# Altium project DM1097_R0M0E0.PrjPcb (part 6 of 7)
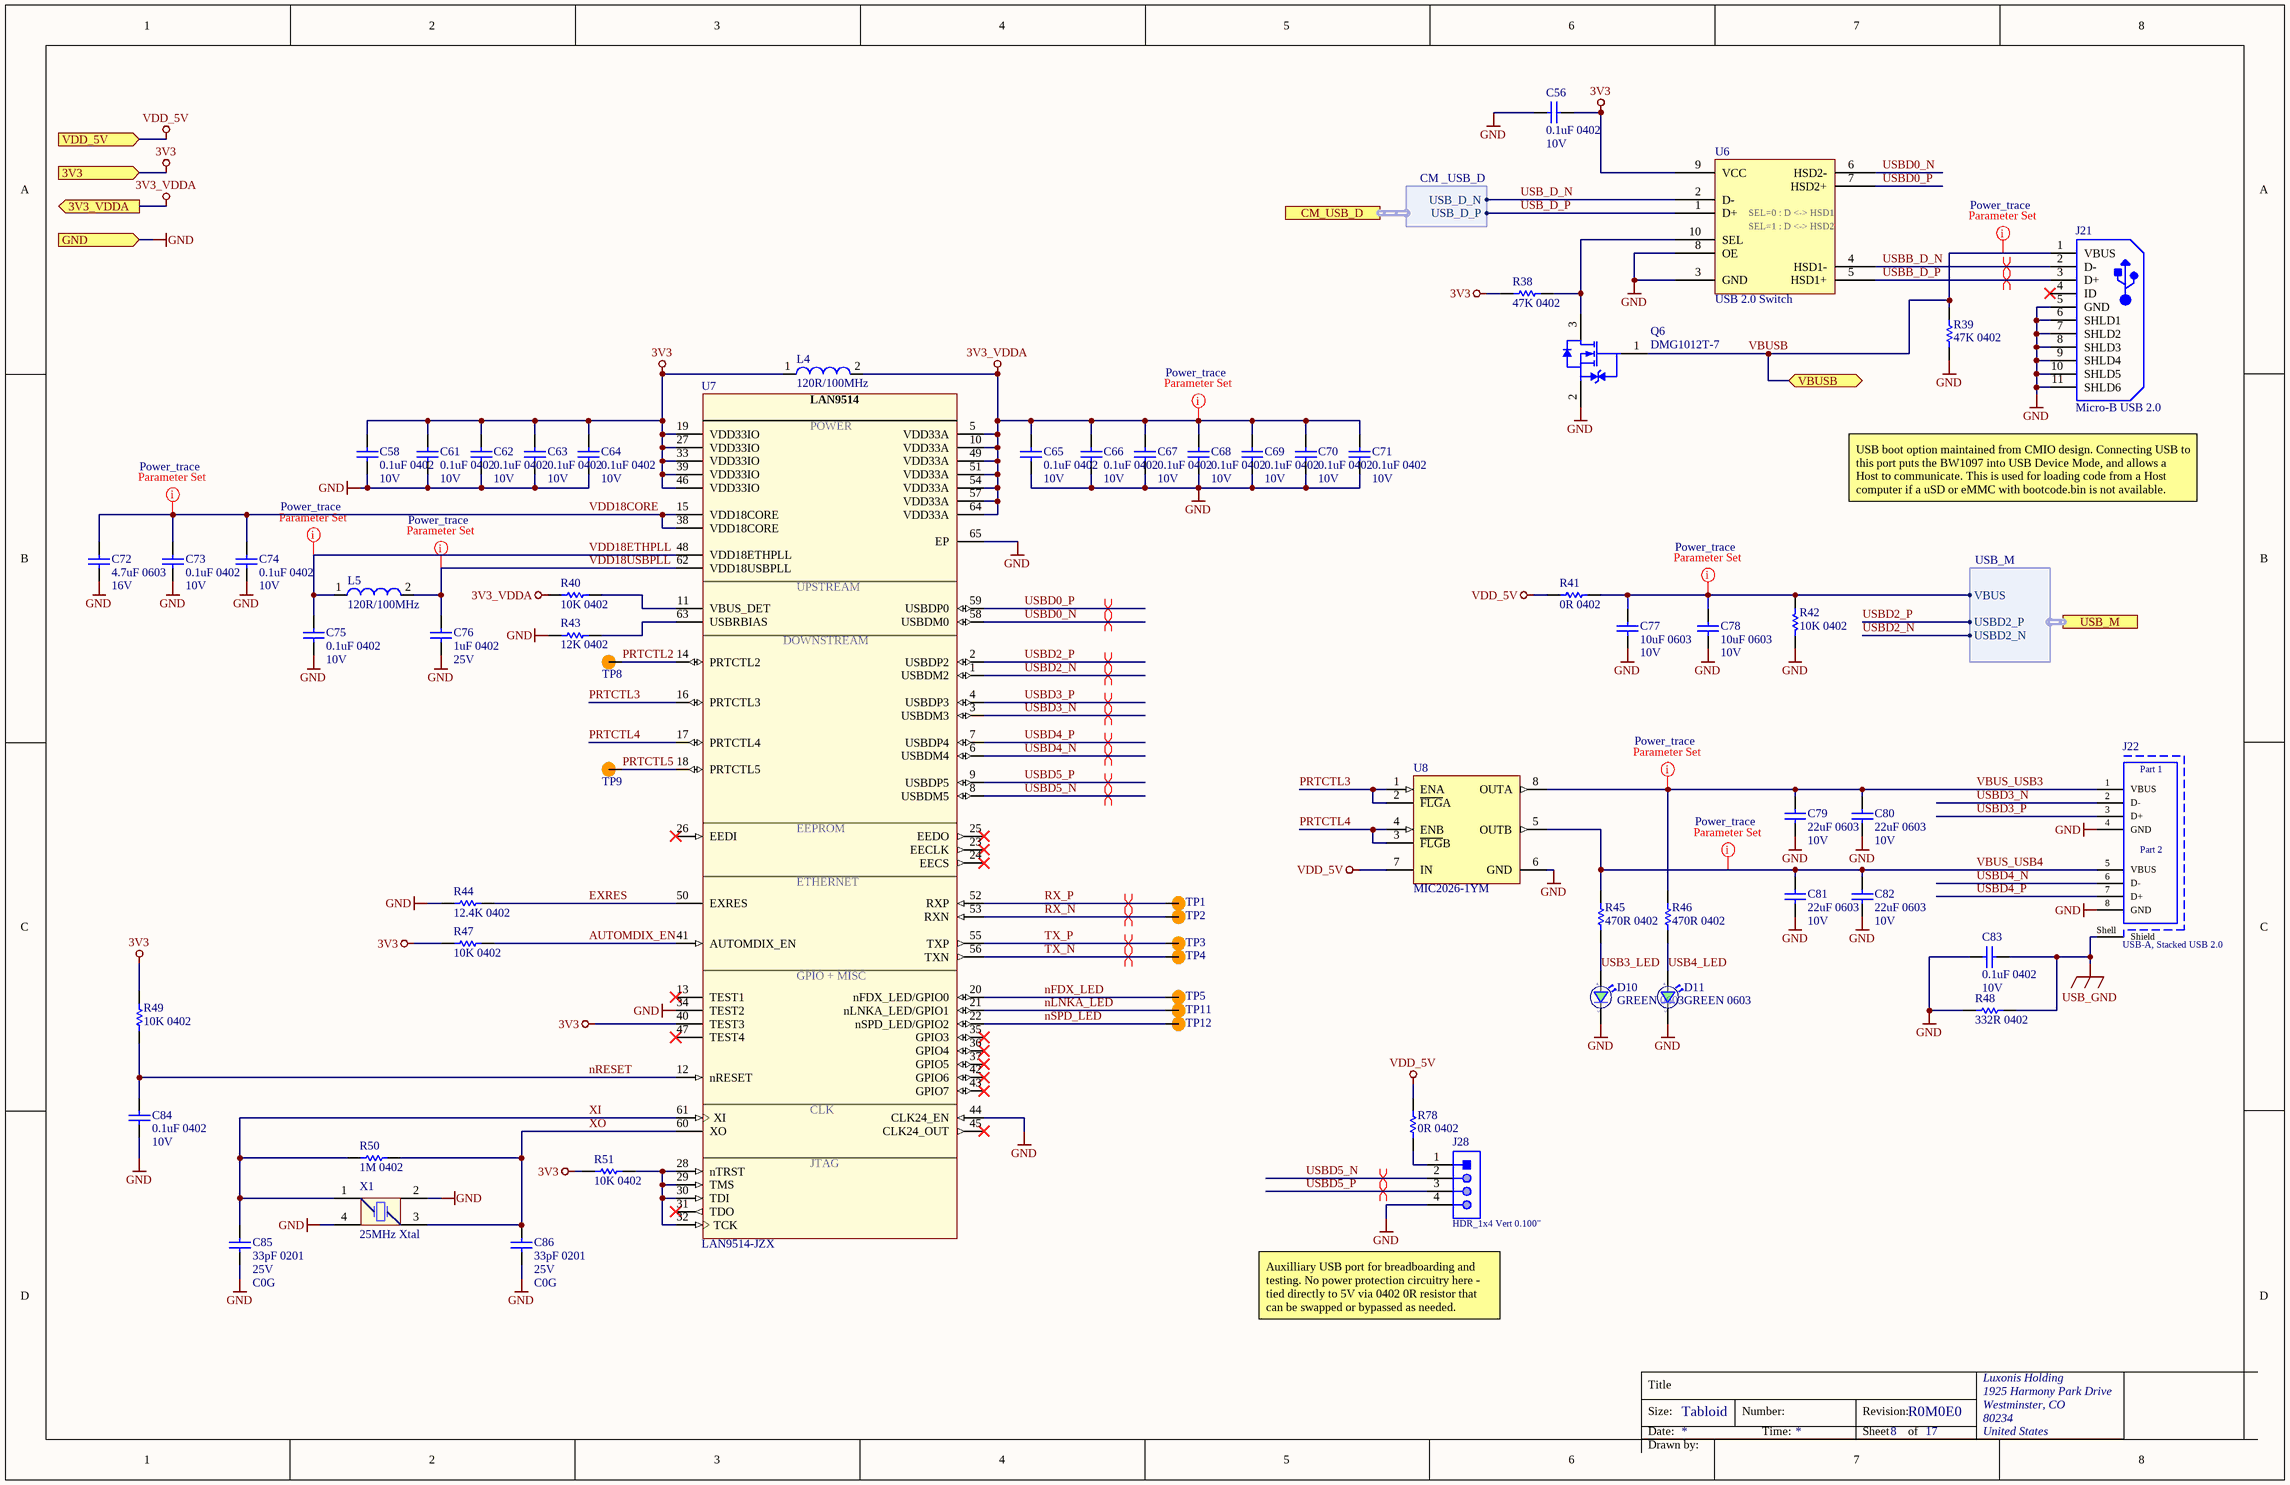
[diagram p15: DM1097_HUB.SchDoc]

## Sheet DM1097_HUB.SchDoc: =project_title (continued)

### Library data of the parts (continued)
X1 = 8Z-25.000MAAJ-T: CRYSTAL 25.0000MHZ 18PF SMD; Manufacturer 1: TXC; Frequency Tolerance: 30ppm; ESR (Equivalent Series Resistance): 100R; Manufacturer Part Number 1: 8Z-25.000MAAJ-T; Supplier 1: Digi-Key; Stock 1: 7343; Pricing 1: 1=1.36000, 10=1.30100, 50=1.27060, 100=1.08900, 500=1.05876, 1000=0.89238 (USD); RoHS: Yes; Mount: Surface Mount; Case/Package: SMD/SMT; Number of Pins: 4; Min Operating Temperature: -10°C; Max Operating Temperature: 70°C; Frequency: 25MHz; Load Capacitance: 18pF; Packaging: Tape and Reel; Package Quantity: 3000; Tolerance: 30ppm; Frequency Stability: 30ppm; Termination: SMD/SMT; Length: 2.5mm; Height: 0.022inch; Width: 2mm; Depth: 2.05mm; REACH SVHC: No SVHC; Lead Free: Lead Free; ComponentLink1URL: https://datasheet.ciiva.com/26833/getdatasheetpartid-743023-26833236.pdf?src-supplier=Verical; ComponentLink1Description: https://datasheet.ciiva.com/26833/getdatasheetpartid-743023-26833236.pdf?src-supplier=Verical; ComponentLink2URL: https://datasheet.ciiva.com/22698/1041872-22698773.pdf?src-supplier=Element14; ComponentLink2Description: https://datasheet.ciiva.com/22698/1041872-22698773.pdf?src-supplier=Element14; ComponentLink3URL: https://datasheet.ciiva.com/1356/number-crystal-basic-1356678.pdf?src-supplier=Element14; ComponentLink3Description: https://datasheet.ciiva.com/1356/number-crystal-basic-1356678.pdf?src-supplier=Element14; ComponentLink4URL: https://datasheet.ciiva.com/859/8z-859017.pdf?src-supplier=Digi-Key; ComponentLink4Description: https://datasheet.ciiva.com/859/8z-859017.pdf?src-supplier=Digi-Key; ComponentLink5URL: https://datasheet.ciiva.com/859/8z-859018.pdf?src-supplier=Digi-Key; ComponentLink5Description: https://datasheet.ciiva.com/859/8z-859018.pdf?src-supplier=Digi-Key; ComponentLink6URL: https://datasheet.ciiva.com/859/8z-859019.pdf?src-supplier=Digi-Key; ComponentLink6Description: https://datasheet.ciiva.com/859/8z-859019.pdf?src-supplier=Digi-Key; Supplier 2: Mouser; Supplier Part Number 1: 887-1145-1-ND; Supplier Part Number 2: 717-8Z-25.000MAAJ-T

## Sheet DM1097_IMX378.SchDoc: =project_title
size Tabloid; PageSetup: Record=PageOptions|CenterHorizontal=True|CenterVertical=True|PrintScale=0.71|XCorrection=1.00|YCorrection=1.00|PrintKind=0|BorderSize=5000000|LeftOffset=0|BottomOffset=0|Orientation=2|PaperLength=1000|PaperWidth=1000|Scale=100|PaperSource=7|PrintQuality=-4|MediaType=1|DitherType=10|PrintScaleMode=1|PaperKind=A4; CompanyName: Luxonis Holding; DrawnBy: David Malovrh; Organization: Luxonis Holding; Address1: 1925 Harmony Park Drive; Address2: Westminster, CO; Address3: 80234; Address4: United States; DocumentNumber: D0000200; Revision: R0M0E0; SheetNumber: 4; SheetTotal: 17
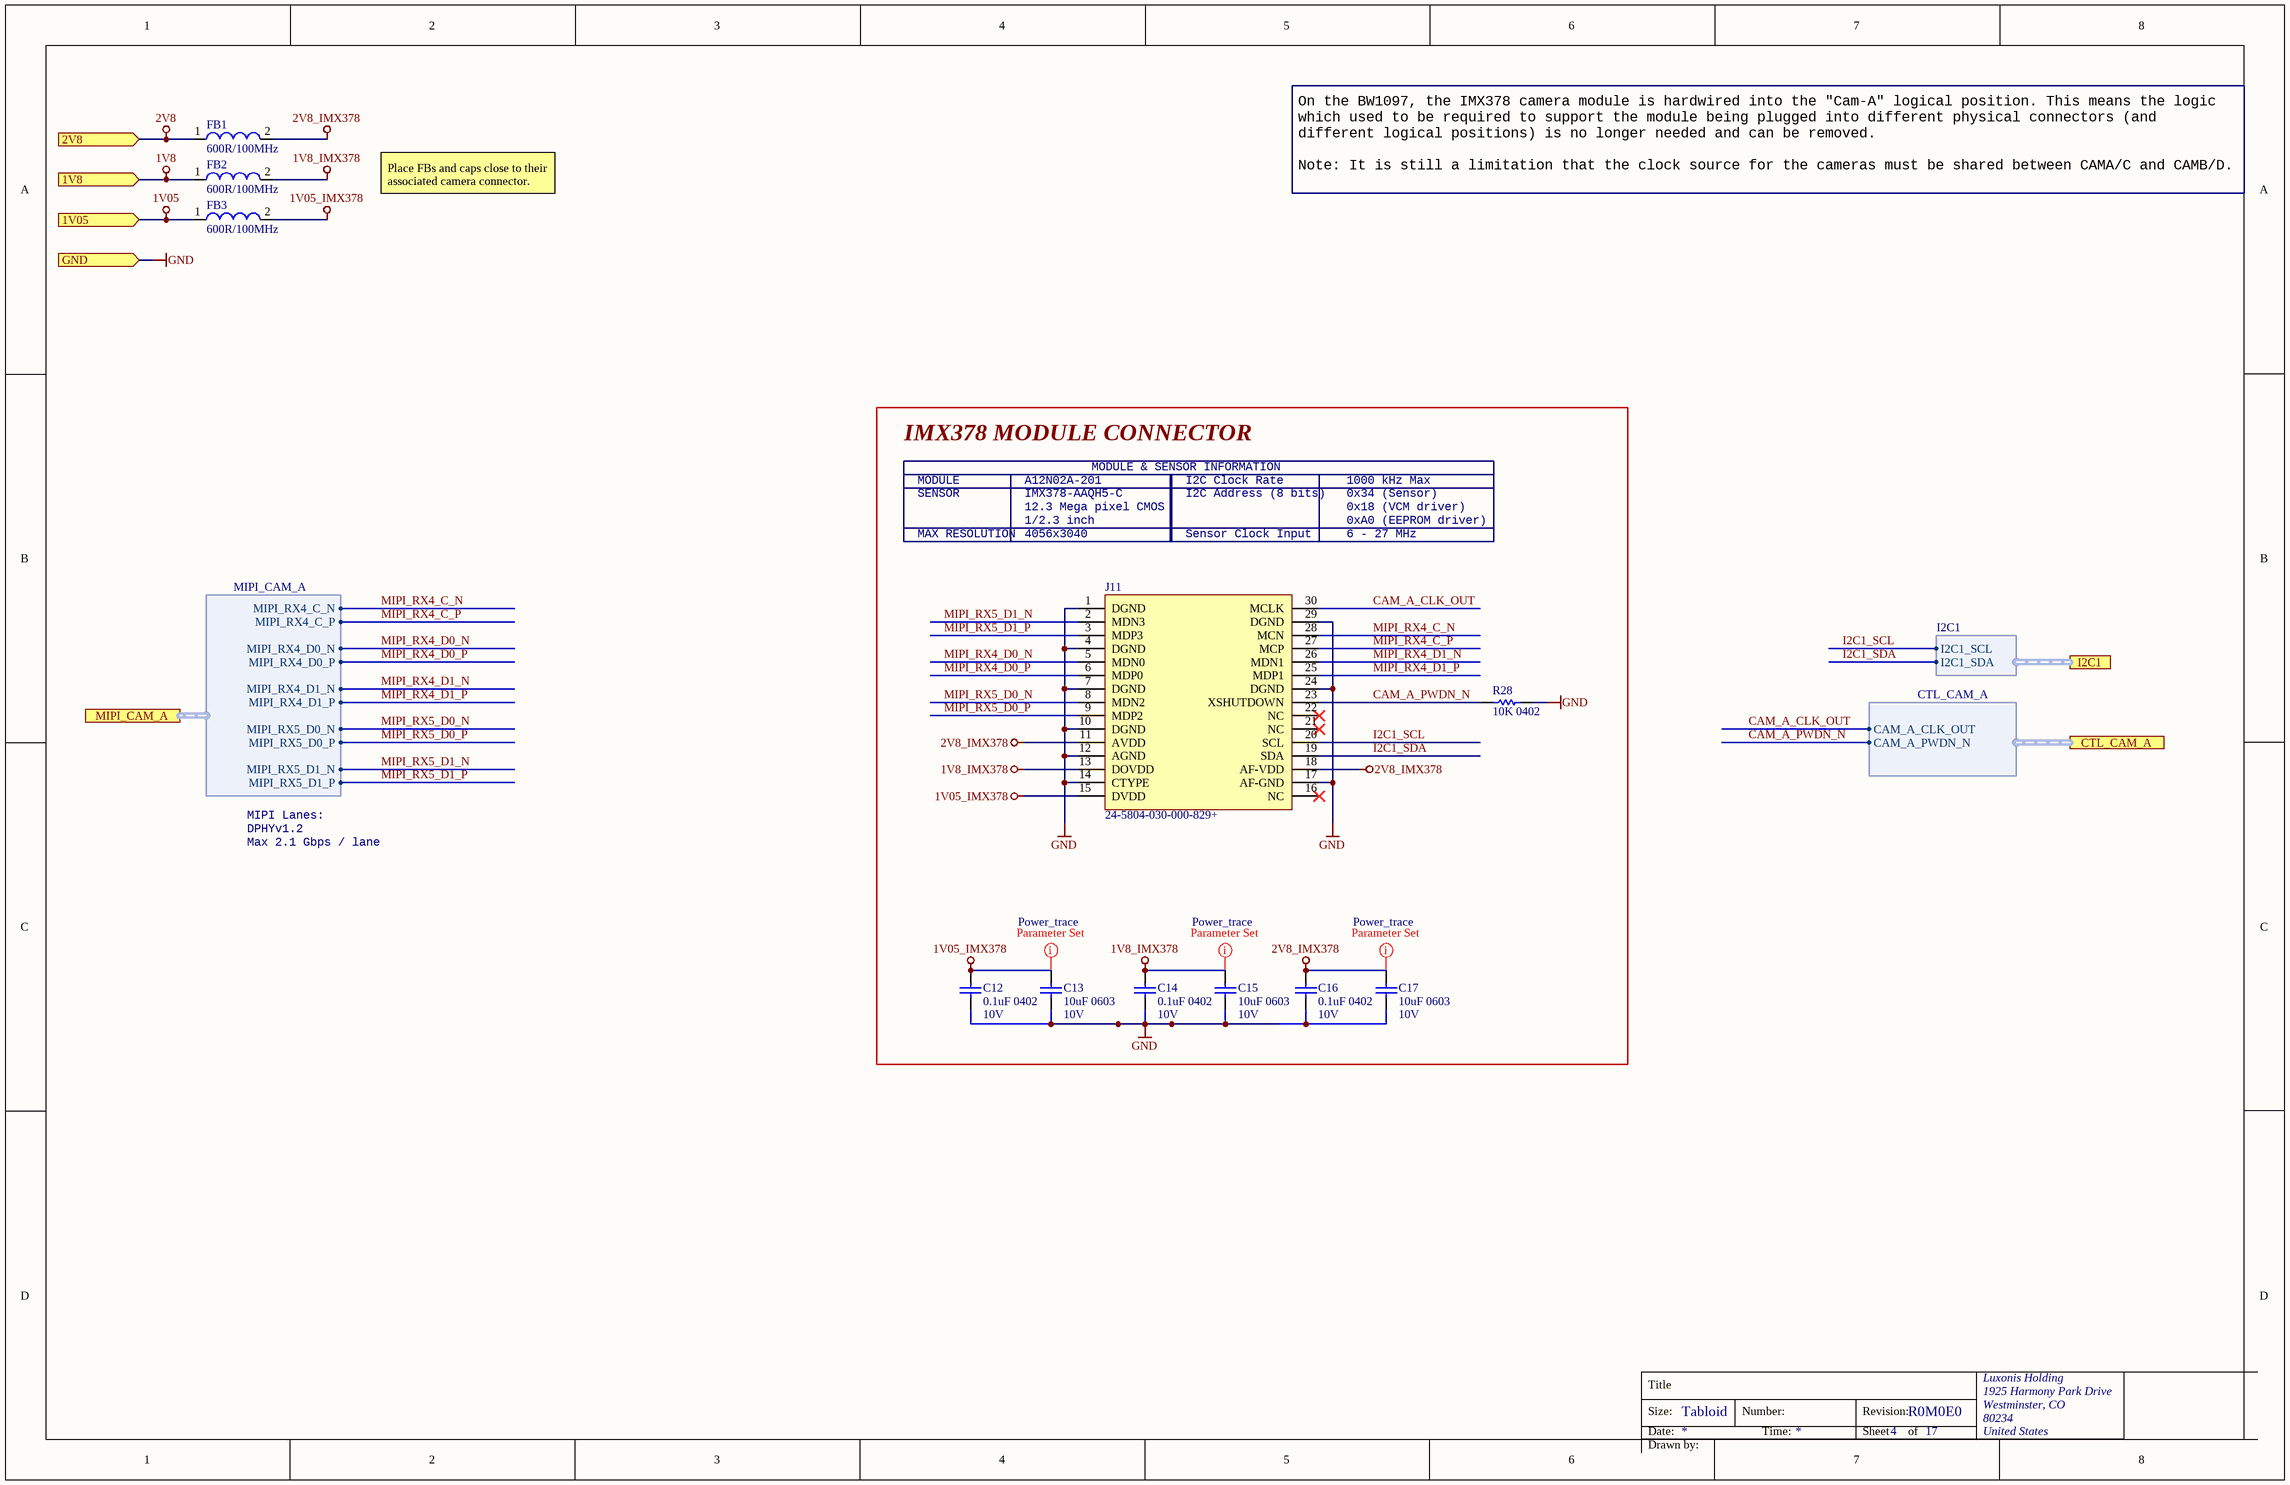
[diagram p5: DM1097_IMX378.SchDoc]

### Parts
C12  0.1uF 0402  Voltage Rating: 10V  [CAPC0402(1005)70_N]
C13  10uF 0603  Voltage Rating: 10V  [CAPC0603(1608)100_N]
C14  0.1uF 0402  Voltage Rating: 10V  [CAPC0402(1005)70_N]
C15  10uF 0603  Voltage Rating: 10V  [CAPC0603(1608)100_N]
C16  0.1uF 0402  Voltage Rating: 10V  [CAPC0402(1005)70_N]
C17  10uF 0603  Voltage Rating: 10V  [CAPC0603(1608)100_N]
FB1  600R/100MHz  [2508056017Y2]
FB2  600R/100MHz  [2508056017Y2]
FB3  600R/100MHz  [2508056017Y2]
J11  24-5804-030-000-829+  [A12N02A-201_MatedModule]
R28  10K 0402  [RESC0402(1005)_N]

### Blocks framed on the sheet
IMX378 MODULE CONNECTOR: C12-C17 J11 R28

### Ports
1V05 (in), 1V8 (in), 2V8 (in), CTL_CAM_A (harness CTL_CAM_A), GND (in), I2C1 (harness I2C1), MIPI_CAM_A (harness MIPI_CAM_A)

### Harnesses
I2C1: I2C1_SDA, I2C1_SCL
MIPI_CAM_A: MIPI_RX4_C_P, MIPI_RX4_C_N, MIPI_RX4_D0_P, MIPI_RX4_D0_N, MIPI_RX4_D1_P, MIPI_RX4_D1_N, MIPI_RX5_D0_P, MIPI_RX5_D0_N, MIPI_RX5_D1_P, MIPI_RX5_D1_N
CTL_CAM_A: CAM_A_PWDN_N, CAM_A_CLK_OUT

### Nets
1V05: FB3.1 ; port 1V05
1V05_IMX378: C12.2 C13.2 FB3.2 J11.15(DVDD)
1V8: FB2.1 ; port 1V8
1V8_IMX378: C14.2 C15.2 FB2.2 J11.13(DOVDD)
2V8: FB1.1 ; port 2V8
2V8_IMX378: C16.2 C17.2 FB1.2 J11.11(AVDD) J11.18(AF-VDD)
GND: C12.1 C13.1 C14.1 C15.1 C16.1 C17.1 J11.1(DGND) J11.4(DGND) J11.7(DGND) J11.10(DGND) J11.12(AGND) J11.14(CTYPE) J11.17(AF-GND) J11.24(DGND) J11.29(DGND) R28.2 ; port GND
CAM_A_CLK_OUT: J11.30(MCLK) ; port CTL_CAM_A.CAM_A_CLK_OUT
CAM_A_PWDN_N: J11.23(XSHUTDOWN) R28.1 ; port CTL_CAM_A.CAM_A_PWDN_N
I2C1_SCL: J11.20(SCL) ; port I2C1.I2C1_SCL
I2C1_SDA: J11.19(SDA) ; port I2C1.I2C1_SDA
MIPI_RX4_C_N: J11.28(MCN) ; port MIPI_CAM_A.MIPI_RX4_C_N
MIPI_RX4_C_P: J11.27(MCP) ; port MIPI_CAM_A.MIPI_RX4_C_P
MIPI_RX4_D0_N: J11.5(MDN0) ; port MIPI_CAM_A.MIPI_RX4_D0_N
MIPI_RX4_D0_P: J11.6(MDP0) ; port MIPI_CAM_A.MIPI_RX4_D0_P
MIPI_RX4_D1_N: J11.26(MDN1) ; port MIPI_CAM_A.MIPI_RX4_D1_N
MIPI_RX4_D1_P: J11.25(MDP1) ; port MIPI_CAM_A.MIPI_RX4_D1_P
MIPI_RX5_D0_N: J11.8(MDN2) ; port MIPI_CAM_A.MIPI_RX5_D0_N
MIPI_RX5_D0_P: J11.9(MDP2) ; port MIPI_CAM_A.MIPI_RX5_D0_P
MIPI_RX5_D1_N: J11.2(MDN3) ; port MIPI_CAM_A.MIPI_RX5_D1_N
MIPI_RX5_D1_P: J11.3(MDP3) ; port MIPI_CAM_A.MIPI_RX5_D1_P

Not connected (* = marked no-connect by the designer): J11 16(NC)* 21(NC)* 22(NC)*

### Layout directives
net class Power_trace: 1V05_IMX378, 1V8_IMX378, 2V8_IMX378

### Notes on the sheet
- Place FBs and caps close to their associated camera connector.
- On the BW1097, the IMX378 camera module is hardwired into the "Cam-A" logical position. This means the logic which used to be required to support the module being plugged into different physical connectors (and different logical positions) is no longer needed and can be removed.
  Note: It is still a limitation that the clock source for the cameras must be shared between CAMA/C and CAMB/D.
- SENSOR
- MODULE
- IMX378-AAQH5-C
- A12N02A-201
- MODULE & SENSOR INFORMATION
- I2C Address (8 bits)
- I2C Clock Rate
- 0x34 (Sensor)
- 1000 kHz Max
- MAX RESOLUTION
- 12.3 Mega pixel CMOS
- 4056x3040
- 1/2.3 inch
- Sensor Clock Input
- 0x18 (VCM driver)
- 0xA0 (EEPROM driver)
- 6 - 27 MHz
- MIPI Lanes:
- DPHYv1.2
- Max 2.1 Gbps / lane
- Title
- Size:
- Date:
- Tabloid
- Number:
- Time:
- Revision:
- Sheet
- of
- Drawn by:

### Library data of the parts
C12 C14 C16 = GRM155R71A104JA01D: CAP CER 0.1UF 10V X7R 0402 5%; Manufacturer 1: Murata; Capacitance: 100nF; Manufacturer Part Number 1: GRM155R71A104JA01D; Supplier 1: Digi-Key; Stock 1: 1346709; Pricing 1: 1=0.10000, 10=0.02500, 100=0.01130, 500=0.00806, 1000=0.00633, 2500=0.00575, 5000=0.00529 (USD); RoHS: Yes; Mount: Surface Mount; Case/Package: 0402; Case Code (Imperial): 0402; Case Code (Metric): 1005; Min Operating Temperature: -55°C; Max Operating Temperature: 125°C; Tolerance: 5%; Packaging: Tape and Reel; Voltage Rating (DC): 10V; Dielectric: X7R; Package Quantity: 10000; Termination: SMD/SMT; Length: 1mm; Height: 0.5mm; Width: 0.02inch; Thickness: 0.022inch; Depth: 0.5mm; Radiation Hardening: No; Lead Free: Lead Free; ComponentLink1URL: https://datasheet.ciiva.com/5411/product-5411135.pdf?src-supplier=Mouser; ComponentLink1Description: https://datasheet.ciiva.com/5411/product-5411135.pdf?src-supplier=Mouser; ComponentLink2URL: https://datasheet.ciiva.com/11618/c02e-11618821.pdf?src-supplier=Avnet; ComponentLink2Description: https://datasheet.ciiva.com/11618/c02e-11618821.pdf?src-supplier=Avnet; Supplier Part Number 1: 490-10777-1-ND
C13 C15 C17 = GRM188R61A106ME69D: CAP CER 10UF 10V X5R 0603 20%; Manufacturer 1: Murata; Material: Ceramic; Manufacturer Part Number 1: GRM188R61A106ME69D; Supplier 1: Digi-Key; Stock 1: 2873098; Pricing 1: 1=0.21000, 10=0.14100, 100=0.07130, 500=0.04876, 1000=0.04313 (USD); RoHS: Yes; Mount: Surface Mount; Case/Package: 0603; Weight: 0.000222oz; Case Code (Metric): 1608; Case Code (Imperial): 0603; Min Operating Temperature: -55°C; Max Operating Temperature: 85°C; Packaging: Tape and Reel; Tolerance: 20%; Capacitance: 10uF; Dielectric: X5R; Voltage Rating (DC): 10V; Package Quantity: 4000; Termination: SMD/SMT; Length: 1.6mm; Height: 0.8mm; Width: 0.8mm; Thickness: 0.035inch; Depth: 0.8mm; REACH SVHC: Unknown; Lead Free: Lead Free; ComponentLink1URL: http://www.mouser.com/ds/2/281/c02e-2905.pdf?src-supplier=Mouser; ComponentLink1Description: http://www.mouser.com/ds/2/281/c02e-2905.pdf?src-supplier=Mouser; ComponentLink2URL: http://components.arrow.com/part/dataview/0323_06119472?src-supplier=Arrow+Europe; ComponentLink2Description: http://components.arrow.com/part/dataview/0323_06119472?src-supplier=Arrow+Europe; ComponentLink3URL: http://www.farnell.com/datasheets/2048014.pdf?src-supplier=Farnell; ComponentLink3Description: http://www.farnell.com/datasheets/2048014.pdf?src-supplier=Farnell; ComponentLink4URL: http://www.farnell.com/datasheets/1872210.pdf?src-supplier=Farnell; ComponentLink4Description: http://www.farnell.com/datasheets/1872210.pdf?src-supplier=Farnell; ComponentLink5URL: http://search.murata.co.jp/Ceramy/image/img/A01X/G101/ENG/GRM188R61A106ME69-01.pdf?src-supplier=Digi-Key; ComponentLink5Description: http://search.murata.co.jp/Ceramy/image/img/A01X/G101/ENG/GRM188R61A106ME69-01.pdf?src-supplier=Digi-Key; ComponentLink6URL: http://www.farnell.com/datasheets/1872210.pdf?src-supplier=Newark; ComponentLink6Description: http://www.farnell.com/datasheets/1872210.pdf?src-supplier=Newark; ComponentLink7URL: http://www.farnell.com/datasheets/2048014.pdf?src-supplier=Element14; ComponentLink7Description: http://www.farnell.com/datasheets/2048014.pdf?src-supplier=Element14; ComponentLink8URL: http://www.farnell.com/datasheets/2048014.pdf?src-supplier=Newark; ComponentLink8Description: http://www.farnell.com/datasheets/2048014.pdf?src-supplier=Newark; Supplier Part Number 1: 490-10475-1-ND
FB1-FB3 = 2508056017Y2: FERRITE BEAD, 0.1OHM, 2A, 0805, 600R/100MHz; Manufacturer 1: Fair-Rite; Impedance: 600R; Tolerance: 25%; Resistance: 350mR; DC Resistance (DCR): 100mR; Test Frequency: 100MHz; Manufacturer Part Number 1: 2508056017Y2; Supplier 1: Digi-Key; Stock 1: 100491; Pricing 1: 1=0.10000, 10=0.07900, 25=0.07120, 50=0.05240, 100=0.04520, 250=0.03568, 500=0.03014, 1000=0.02538 (USD); RoHS: Yes; Case/Package: 0805; Number of Pins: 2; Case Code (Metric): 2012; Case Code (Imperial): 0805; Min Operating Temperature: -55°C; Max Operating Temperature: 125°C; Package Quantity: 4000; Packaging: Tape and Reel; Max DC Current: 2A; Termination: SMD/SMT; Military Standard: Not; DC Current: 2A; Current Rating: 2A; Frequency: 100MHz; Length: 2mm; Height: 0.9mm; Width: 1.25mm; Depth: 1.25mm; Radiation Hardening: No; REACH SVHC: No SVHC; ComponentLink1URL: https://datasheet.ciiva.com/3854/3802508056017y2-3854245.pdf?src-supplier=Arrow; ComponentLink1Description: https://datasheet.ciiva.com/3854/3802508056017y2-3854245.pdf?src-supplier=Arrow; ComponentLink2URL: https://datasheet.ciiva.com/22735/652149-22735047.pdf?src-supplier=Element14; ComponentLink2Description: https://datasheet.ciiva.com/22735/652149-22735047.pdf?src-supplier=Element14; ComponentLink3URL: https://datasheet.ciiva.com/1127/26143-1127514.pdf?src-supplier=Farnell; ComponentLink3Description: https://datasheet.ciiva.com/1127/26143-1127514.pdf?src-supplier=Farnell; ComponentLink4URL: https://datasheet.ciiva.com/18090/getdatasheetpartid-212640-18090187.pdf?src-supplier=Verical; ComponentLink4Description: https://datasheet.ciiva.com/18090/getdatasheetpartid-212640-18090187.pdf?src-supplier=Verical; ComponentLink5URL: https://datasheet.ciiva.com/7620/26143-7620140.pdf?src-supplier=Element14; ComponentLink5Description: https://datasheet.ciiva.com/7620/26143-7620140.pdf?src-supplier=Element14; Supplier Part Number 1: 1934-1487-1-ND
J11 = A12N02A-201_Connector: CONN Series 5804 board to board 0.4mm pitch 30 way connector; Manufacturer 1: Kyocera International Electronic Components; Manufacturer Part Number 1: 245804030000829+; MAN: AVX/KYOCERA; MAN PN: 24-5804-030-000-829+; Supplier 1: Digi-Key; Stock 1: 11469; Pricing 1: 1=1.69000, 10=1.53600, 25=1.44200, 50=1.37940, 100=1.31670, 250=1.19132, 500=1.09726, 1000=0.94050 (USD); RoHS: No; ComponentLink1URL: http://global.kyocera.com/prdct/electro/product/pdf/5804.pdf?src-supplier=Digi-Key; ComponentLink1Description: http://global.kyocera.com/prdct/electro/product/pdf/5804.pdf?src-supplier=Digi-Key; Supplier Part Number 1: 478-12013-1-ND
R28 = RC0402FR-1310KL: RES SMD 10K OHM 1% 0402 1/16W Chip Resistor, 0402 [1005 Metric], 10 kohm, RC Series, 50 V, Thick Film, 62.5 mW; Manufacturer 1: Yageo; Resistance: 10kR; Temperature Coefficient: 100ppm/°C; Power Rating: 62.5mW; Voltage Rating: 50V; Manufacturer Part Number 1: RC0402FR-1310KL; ComponentLink1URL: https://datasheet.ciiva.com/16940/pyu-rc0402-51-rohs-l-6-16940293.pdf?src-supplier=Avnet+Europe; ComponentLink1Description: https://datasheet.ciiva.com/16940/pyu-rc0402-51-rohs-l-6-16940293.pdf?src-supplier=Avnet+Europe; ComponentLink2URL: https://datasheet.ciiva.com/28386/pyu-rc0402-51-rohs-l-6-28386855.pdf?src-supplier=Avnet+Europe; ComponentLink2Description: https://datasheet.ciiva.com/28386/pyu-rc0402-51-rohs-l-6-28386855.pdf?src-supplier=Avnet+Europe; ComponentLink3URL: https://datasheet.ciiva.com/16740/pyu-rc0402-51-rohs-l-6-r-16740602.pdf?src-supplier=Future+Electronics; ComponentLink3Description: https://datasheet.ciiva.com/16740/pyu-rc0402-51-rohs-l-6-r-16740602.pdf?src-supplier=Future+Electronics; ComponentLink4URL: https://datasheet.ciiva.com/8891/pyu-rc0402-51-rohs-l-6-8891339.pdf?src-supplier=Avnet; ComponentLink4Description: https://datasheet.ciiva.com/8891/pyu-rc0402-51-rohs-l-6-8891339.pdf?src-supplier=Avnet; ComponentLink5URL: https://datasheet.ciiva.com/5557/pyu-rc0402-51-rohs-l-6-r-5557997.pdf?src-supplier=Mouser; ComponentLink5Description: https://datasheet.ciiva.com/5557/pyu-rc0402-51-rohs-l-6-r-5557997.pdf?src-supplier=Mouser; ComponentLink6URL: https://datasheet.ciiva.com/7983/1018594-7983533.pdf?src-supplier=Element14; ComponentLink6Description: https://datasheet.ciiva.com/7983/1018594-7983533.pdf?src-supplier=Element14; Supplier 1: Newark; Stock 1: 62239; Pricing 1: 1=0.10000, 25=0.01200, 100=0.00400, 250=0.00400, 500=0.00300, 1000=0.00300 (USD); RoHS: Yes; Case/Package: 0402; Number of Pins: 2; Contact Plating: Tin,Matte,Lead; Case Code (Imperial): 0402; Case Code (Metric): 1005; Min Operating Temperature: -55°C; Max Operating Temperature: 155°C; Tolerance: 1%; Composition: Thick Film; Packaging: Tape and Reel; Termination: SMD/SMT; Military Standard: Not; Voltage Rating (DC): 50V; Working Voltage: 50V; Number of Terminations: 2; Length: 1mm; Depth: 0.5mm; Radiation Hardening: No; REACH SVHC: No SVHC; Lead Free: Lead Free; Supplier Part Number 1: 67R9960; Supplier 2: Future Electronics; Supplier 3: Mouser; Supplier 4: Element14; Supplier Part Number 2: RC0402FR-1310KL-CUTT; Supplier Part Number 3: 603-RC0402FR-1310KL; Supplier Part Number 4: 1799235

## Sheet DM1097_MIPI_IO.SchDoc: =project_title
size Tabloid; CompanyName: Luxonis Holding; DrawnBy: David Malovrh; Organization: Luxonis Holding; Address1: 1925 Harmony Park Drive; Address2: Westminster, CO; Address3: 80234; Address4: United States; DocumentNumber: D0000200; Revision: R0M0E0; SheetNumber: 13; SheetTotal: 17
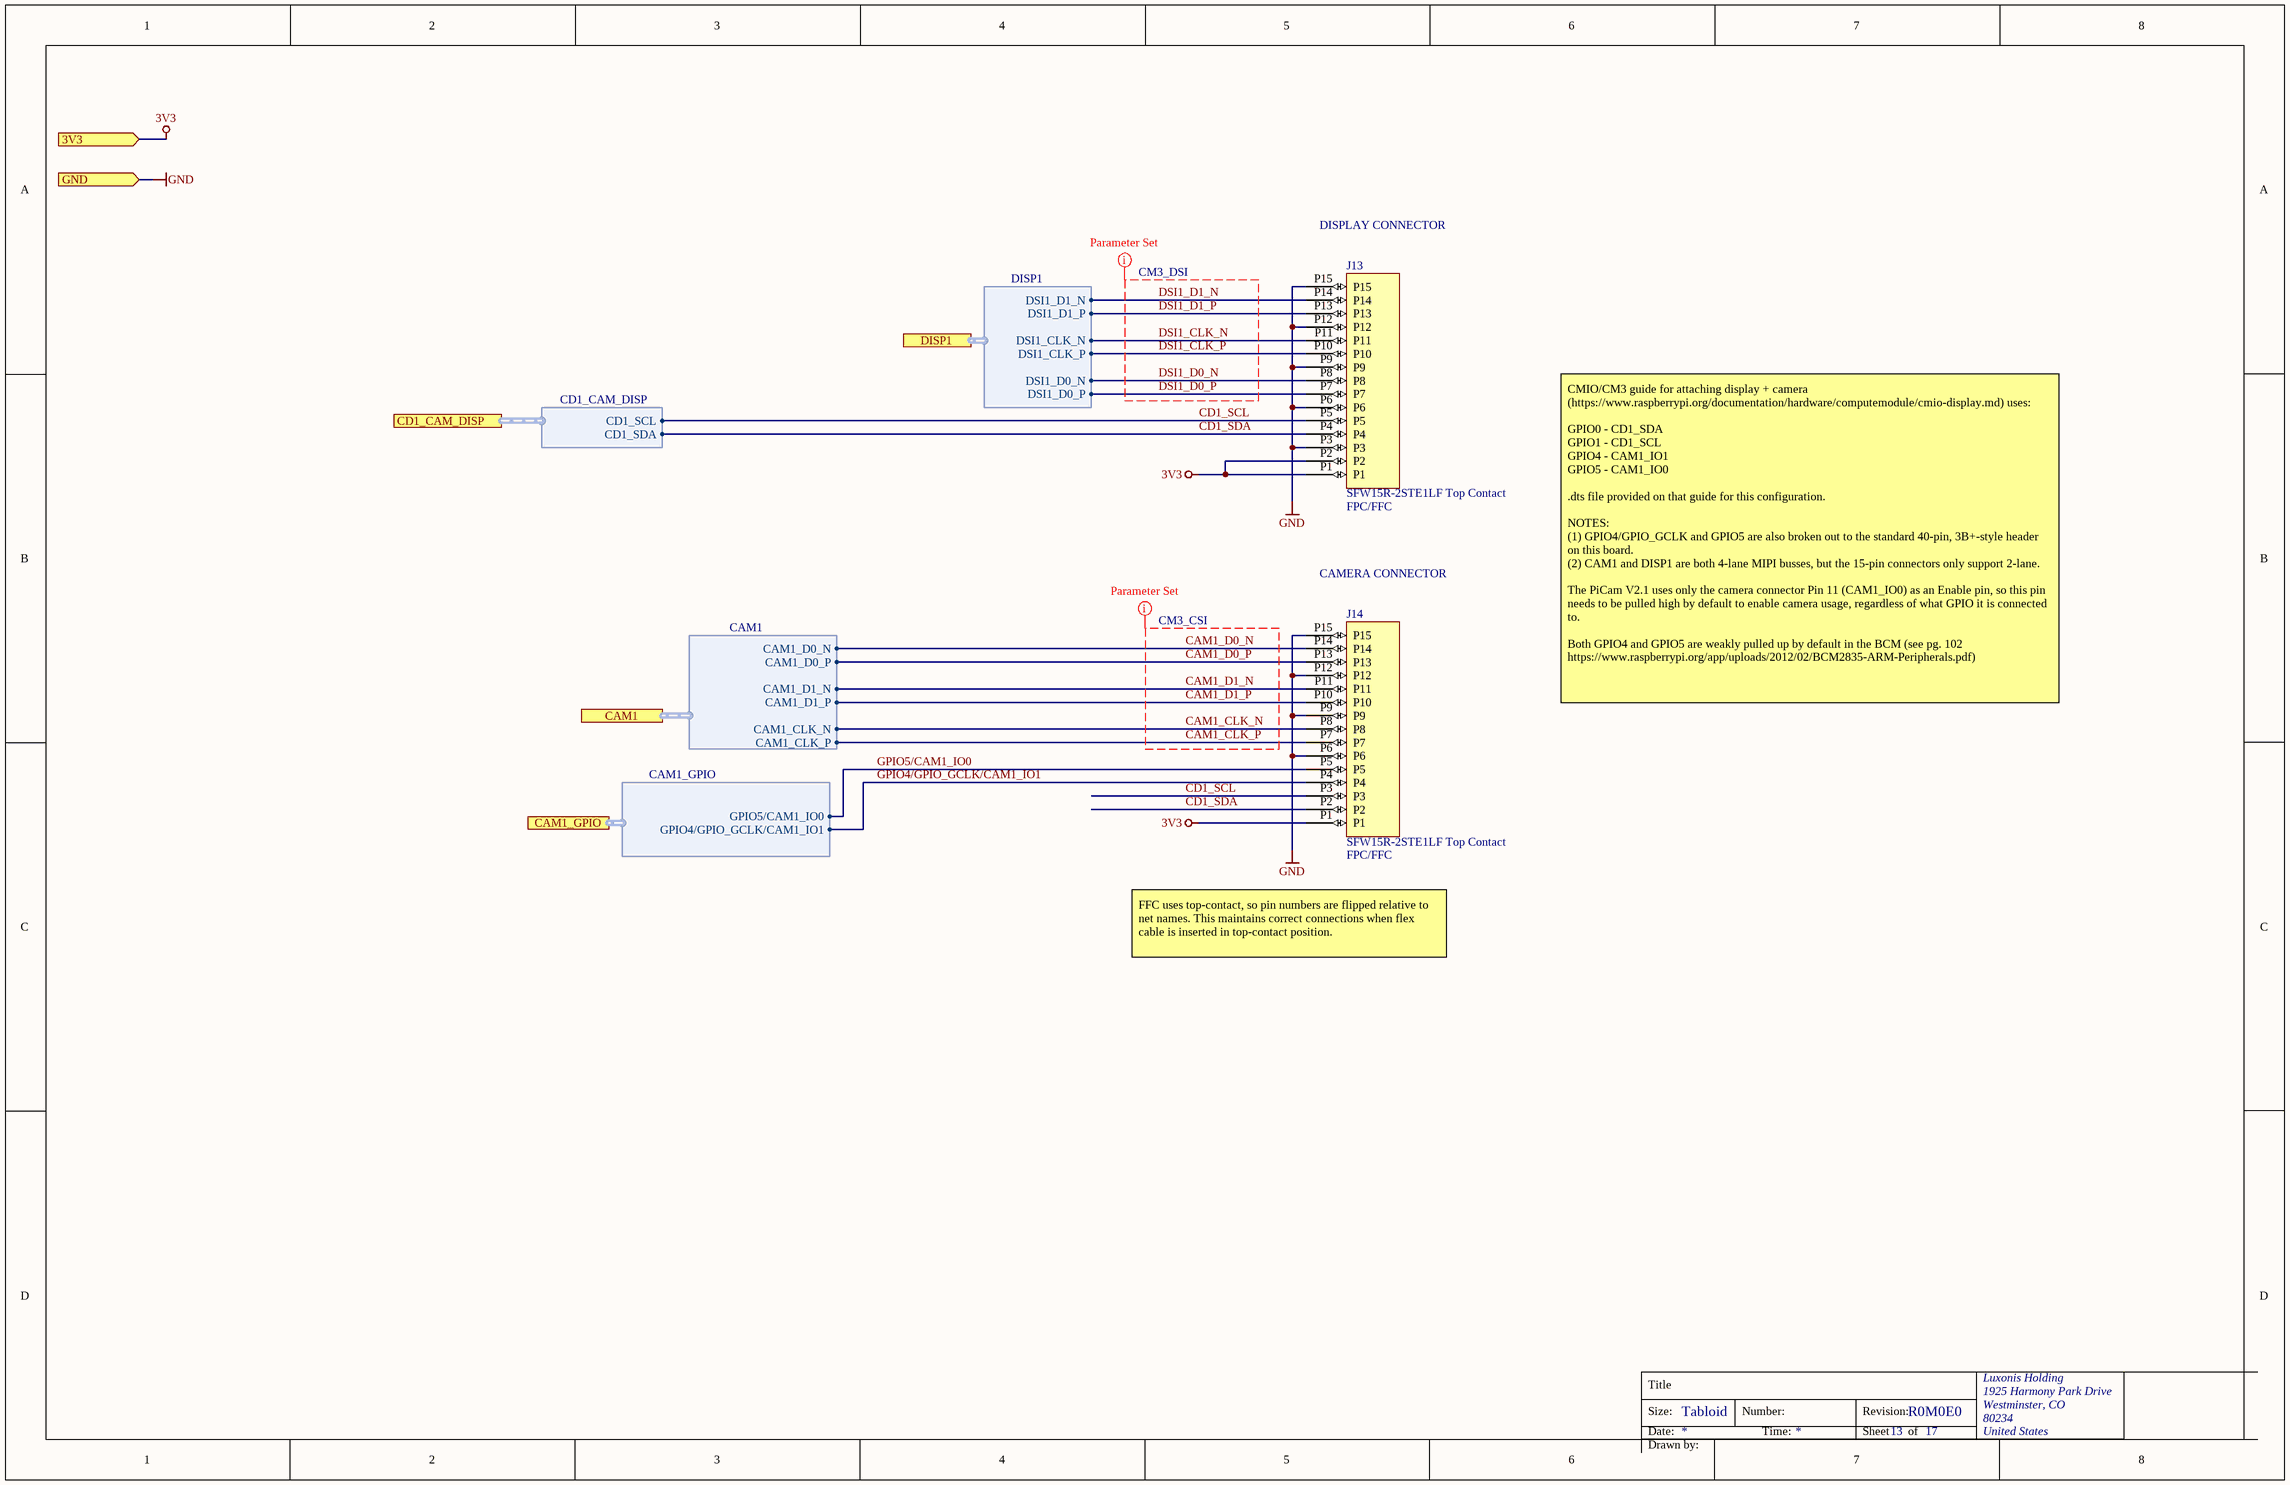
[diagram p6: DM1097_MIPI_IO.SchDoc]

### Parts
J13  SFW15R-2STE1LF Top Contact  Component Subtype: FPC/FFC  [SFW15R-2STE1LF]
J14  SFW15R-2STE1LF Top Contact  Component Subtype: FPC/FFC  [SFW15R-2STE1LF]

### Ports
3V3 (in), CAM1 (harness CAM1), CAM1_GPIO (harness CAM1_GPIO), CD1_CAM_DISP (harness CD1_CAM_DISP), DISP1 (harness DISP1), GND (in)

### Harnesses
CD1_CAM_DISP: CD1_SCL, CD1_SDA
CAM1: CAM1_D0_N, CAM1_D0_P, CAM1_D1_N, CAM1_D1_P, CAM1_CLK_N, CAM1_CLK_P
DISP1: DSI1_D1_N, DSI1_D1_P, DSI1_CLK_N, DSI1_CLK_P, DSI1_D0_N, DSI1_D0_P
CAM1_GPIO: GPIO4/GPIO_GCLK/CAM1_IO1, GPIO5/CAM1_IO0

### Nets
3V3: J13.P1 J13.P2 J14.P1 ; port 3V3
GND: J13.P3 J13.P6 J13.P9 J13.P12 J13.P15 J14.P6 J14.P9 J14.P12 J14.P15 ; port GND
CAM1_CLK_N: J14.P8 ; port CAM1.CAM1_CLK_N
CAM1_CLK_P: J14.P7 ; port CAM1.CAM1_CLK_P
CAM1_D0_N: J14.P14 ; port CAM1.CAM1_D0_N
CAM1_D0_P: J14.P13 ; port CAM1.CAM1_D0_P
CAM1_D1_N: J14.P11 ; port CAM1.CAM1_D1_N
CAM1_D1_P: J14.P10 ; port CAM1.CAM1_D1_P
CD1_SCL: J13.P5 J14.P3 ; port CD1_CAM_DISP.CD1_SCL
CD1_SDA: J13.P4 J14.P2 ; port CD1_CAM_DISP.CD1_SDA
DSI1_CLK_N: J13.P11 ; port DISP1.DSI1_CLK_N
DSI1_CLK_P: J13.P10 ; port DISP1.DSI1_CLK_P
DSI1_D0_N: J13.P8 ; port DISP1.DSI1_D0_N
DSI1_D0_P: J13.P7 ; port DISP1.DSI1_D0_P
DSI1_D1_N: J13.P14 ; port DISP1.DSI1_D1_N
DSI1_D1_P: J13.P13 ; port DISP1.DSI1_D1_P
GPIO4/GPIO_GCLK/CAM1_IO1: J14.P4 ; port CAM1_GPIO.GPIO4/GPIO_GCLK/CAM1_IO1
GPIO5/CAM1_IO0: J14.P5 ; port CAM1_GPIO.GPIO5/CAM1_IO0

### Layout directives
net class CM3_DSI; rule Matched Net Lengths [Tolerance = 5mil]: DSI1_CLK_N, DSI1_CLK_P, DSI1_D0_N, DSI1_D0_P, DSI1_D1_N, DSI1_D1_P
net class CM3_CSI; rule Matched Net Lengths [Tolerance = 5mil]: CAM1_CLK_N, CAM1_CLK_P, CAM1_D0_N, CAM1_D0_P, CAM1_D1_N, CAM1_D1_P

### Notes on the sheet
- DISPLAY CONNECTOR
- CAMERA CONNECTOR
- CMIO/CM3 guide for attaching display + camera (https://www.raspberrypi.org/documentation/hardware/computemodule/cmio-display.md) uses:
  GPIO0 - CD1_SDA
  GPIO1 - CD1_SCL
  GPIO4 - CAM1_IO1
  GPIO5 - CAM1_IO0
  .dts file provided on that guide for this configuration.
  NOTES:
  (1) GPIO4/GPIO_GCLK and GPIO5 are also broken out to the standard 40-pin, 3B+-style header on this board.
  (2) CAM1 and DISP1 are both 4-lane MIPI busses, but the 15-pin connectors only support 2-lane.
  The PiCam V2.1 uses only the camera connector Pin 11 (CAM1_IO0) as an Enable pin, so this pin needs to be pulled high by default to enable camera usage, regardless of what GPIO it is connected to.
  Both GPIO4 and GPIO5 are weakly pulled up by default in the BCM (see pg. 102 https://www.raspberrypi.org/app/uploads/2012/02/BCM2835-ARM-Peripherals.pdf)
- FFC uses top-contact, so pin numbers are flipped relative to net names. This maintains correct connections when flex cable is inserted in top-contact position.
- Title
- Size:
- Date:
- Tabloid
- Number:
- Time:
- Revision:
- Sheet
- of
- Drawn by:

### Library data of the parts
J13 J14 = SFW15R-2STE1LF: CONN FFC FPC TOP 15POS 1MM R/A; Manufacturer: Amphenol; Manufacturer 1: Amphenol FCI; Actuator Material: Glass; Current Rating: 1A; Voltage Rating: 100V; Contact Resistance: 30mR; Number of Positions: 15; Insulation Resistance: 500MR; Wire/Cable Type: Straight; Component Type: Connector; Mount: SMT; Manufacturer PN: SFW15R-2STE1LF; Supplier 1: Digi-Key; Manufacturer Part Number 1: SFW15R-2STE1LF; Stock 1: 4348; Pricing 1: 1=0.51000, 10=0.48200, 25=0.43400, 50=0.38580, 100=0.36960, 250=0.33748, 500=0.32142, 1000=0.26517 (USD); Contact Material: Bronze; Contact Plating: Tin; Housing Color: Brown; Housing Material: Polyphenylene; Min Operating Temperature: -55°C; Max Operating Temperature: 105°C; Packaging: Tape and Reel; Number of Rows: 1; Package Quantity: 2000; Voltage Rating (AC): 100V; Termination: Solder; Contact Location: Top; Number of Contacts: 15; Max Voltage Rating (AC): 100V; Orientation: Right Angle; Length: 20.8mm; Pitch: 1mm; Depth: 6mm; Width: 5.5mm; Lead Free: Lead Free; Flammability Rating: UL94 V-0; ComponentLink1URL: https://datasheet.ciiva.com/670/sfw12lf-670088.pdf?src-supplier=Digi-Key; ComponentLink1Description: https://datasheet.ciiva.com/670/sfw12lf-670088.pdf?src-supplier=Digi-Key; ComponentLink2URL: https://datasheet.ciiva.com/670/sfw12lf-670089.pdf?src-supplier=Digi-Key; ComponentLink2Description: https://datasheet.ciiva.com/670/sfw12lf-670089.pdf?src-supplier=Digi-Key; ComponentLink3URL: https://datasheet.ciiva.com/670/sfw12lf-670090.pdf?src-supplier=Digi-Key; ComponentLink3Description: https://datasheet.ciiva.com/670/sfw12lf-670090.pdf?src-supplier=Digi-Key; ComponentLink4URL: https://datasheet.ciiva.com/5138/sfw12lf-5138988.pdf?src-supplier=Mouser; ComponentLink4Description: https://datasheet.ciiva.com/5138/sfw12lf-5138988.pdf?src-supplier=Mouser; ComponentLink5URL: http://datasheet.octopart.com/SFW15R-2STE1LF-Areva-datasheet-119238.pdf?src-supplier=Mouser; ComponentLink5Description: http://datasheet.octopart.com/SFW15R-2STE1LF-Areva-datasheet-119238.pdf?src-supplier=Mouser; ComponentLink6URL: http://datasheet.octopart.com/SFW15R-2STE1LF-Areva-datasheet-8760026.pdf?src-supplier=_legacy+Avnet; ComponentLink6Description: http://datasheet.octopart.com/SFW15R-2STE1LF-Areva-datasheet-8760026.pdf?src-supplier=_legacy+Avnet; ComponentLink7URL: http://datasheet.octopart.com/SFW15R-2STE1LF-Amphenol-datasheet-94059633.pdf?src-supplier=Newark; ComponentLink7Description: http://datasheet.octopart.com/SFW15R-2STE1LF-Amphenol-datasheet-94059633.pdf?src-supplier=Newark; ComponentLink8URL: http://datasheet.octopart.com/SFW15R-2STE1LF-Amphenol-ICC-datasheet-94059633.pdf?src-supplier=Farnell; ComponentLink8Description: http://datasheet.octopart.com/SFW15R-2STE1LF-Amphenol-ICC-datasheet-94059633.pdf?src-supplier=Farnell; ComponentLink9URL: http://datasheet.octopart.com/SFW15R-2STE1LF-Amphenol-ICC-datasheet-8760026.pdf?src-supplier=Future+Electronics; ComponentLink9Description: http://datasheet.octopart.com/SFW15R-2STE1LF-Amphenol-ICC-datasheet-8760026.pdf?src-supplier=Future+Electronics; Supplier Part Number 1: 609-1906-1-ND; RoHS: Yes; Supplier 2: Digi-Key; Manufacturer 2: Amphenol FCI; Manufacturer Part Number 2: SFW15R-2STE1LF; Stock 2: 4348; Pricing 2: 1=0.51000, 10=0.48200, 25=0.43400, 50=0.38580, 100=0.36960, 250=0.33748, 500=0.32142, 1000=0.26517 (USD); Supplier 3: Mouser; Manufacturer 3: Amphenol FCI; Manufacturer Part Number 3: SFW15R-2STE1LF; Stock 3: 4218; Pricing 3: 1=0.46000, 10=0.35000, 100=0.33600, 500=0.29200, 1000=0.24100, 2000=0.21900, 4000=0.21100, 10000=0.19700, 24000=0.19400 (USD); Supplier Part Number 2: 609-1906-6-ND; Supplier Part Number 3: 649-SFW15R-2STE1LF

## Sheet DM1097_MODULE.SchDoc: =project_title
size Tabloid; CompanyName: Luxonis Holding; DrawnBy: David Malovrh; Organization: Luxonis Holding; Address1: 1925 Harmony Park Drive; Address2: Westminster, CO; Address3: 80234; Address4: United States; DocumentNumber: D0000200; Revision: R0M0E0; SheetNumber: 9; SheetTotal: 17
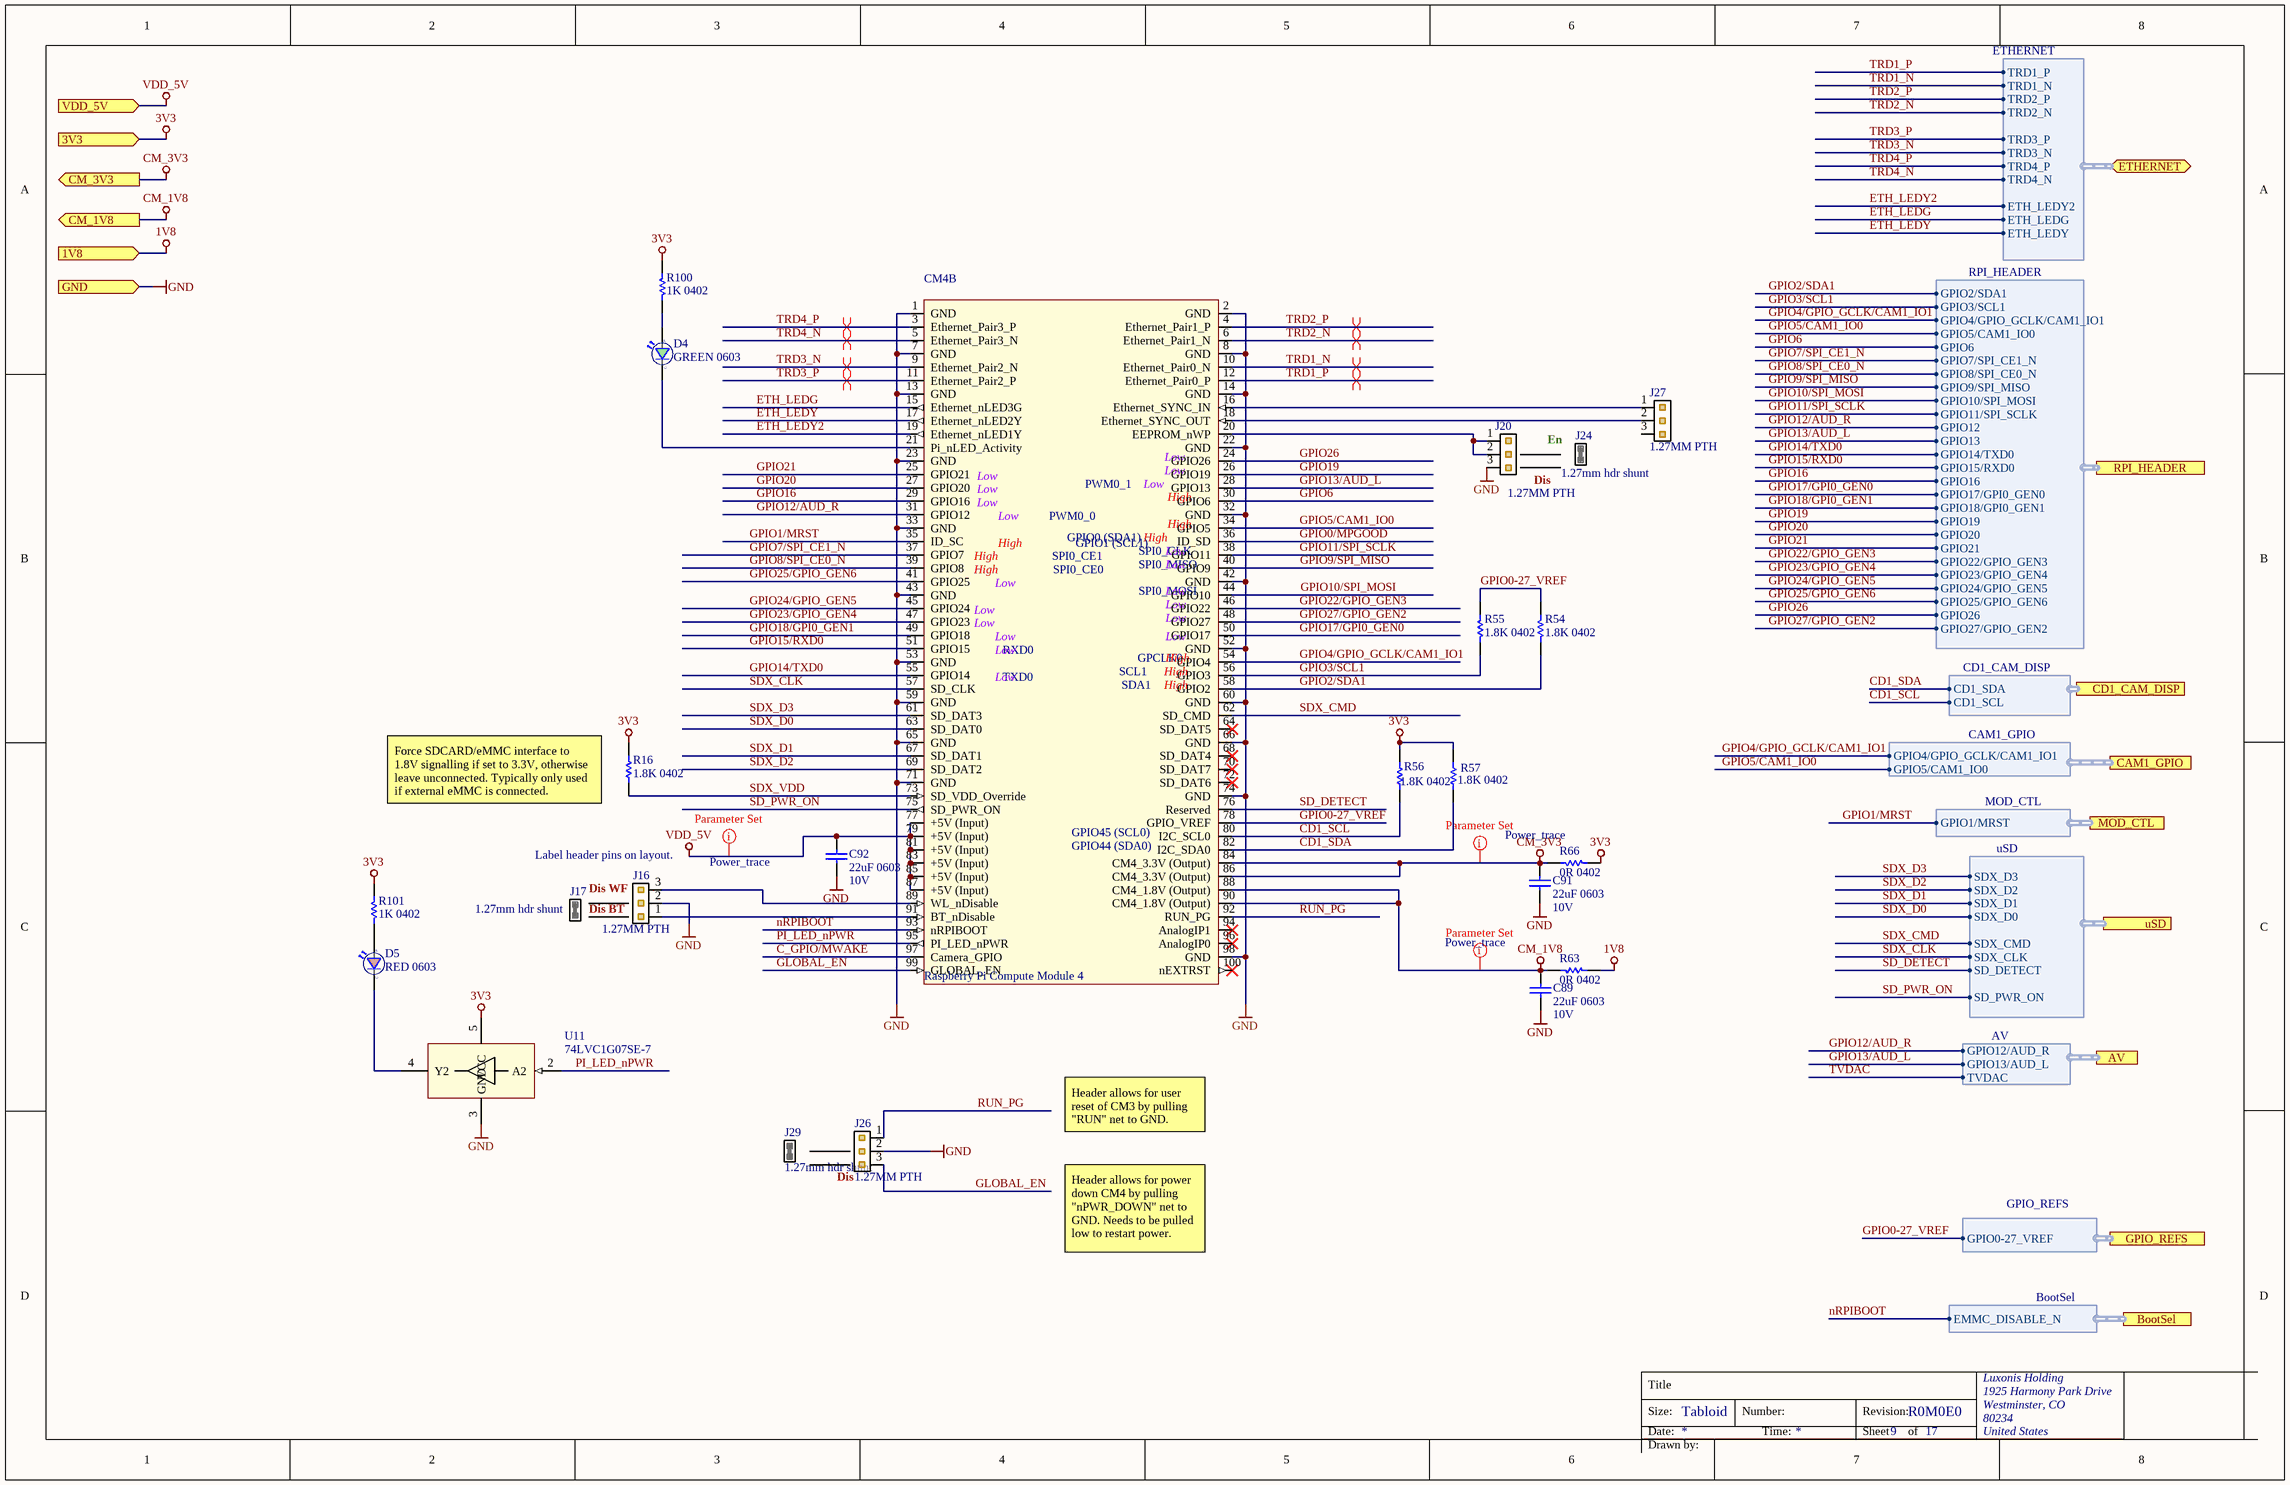
[diagram p7: DM1097_MODULE.SchDoc]

### Parts
C89  22uF 0603  Voltage Rating: 10V  [CAPC0603(1608)100_N]
C91  22uF 0603  Voltage Rating: 10V  [CAPC0603(1608)100_N]
C92  22uF 0603  Voltage Rating: 10V  [CAPC0603(1608)100_N]
CM4  Raspberry Pi Compute Module 4  [CM4-DF40HC(3.0)-100DS-0.4v_3mm_1.5mm]  (part B of 2)
D4  GREEN 0603  [SML_D1xx8W]
D5  RED 0603  [SML_D1xx8W]
J16  1.27MM PTH  [GRPB031VWVN-RC]
J17  1.27mm hdr shunt  [M50-1900005]
J20  1.27MM PTH  [GRPB031VWVN-RC]
J24  1.27mm hdr shunt  [M50-1900005]
J26  1.27MM PTH  [GRPB031VWVN-RC]
J27  1.27MM PTH  [GRPB031VWVN-RC]
J29  1.27mm hdr shunt  [M50-1900005]
R16  1.8K 0402  [RESC0402(1005)_N]
R54  1.8K 0402  [RESC0402(1005)_N]
R55  1.8K 0402  [RESC0402(1005)_N]
R56  1.8K 0402  [RESC0402(1005)_N]
R57  1.8K 0402  [RESC0402(1005)_N]
R63  0R 0402  [RESC0402(1005)_N]
R66  0R 0402  [RESC0402(1005)_N]
R100  1K 0402  [RESC0402(1005)_N]
R101  1K 0402  [RESC0402(1005)_N]
U11  74LVC1G07SE-7  [74LVC1G07SE-7]

### Ports
1V8 (in), 3V3 (in), AV (harness AV), BootSel (harness BootSel), CAM1_GPIO (harness CAM1_GPIO), CD1_CAM_DISP (harness CD1_CAM_DISP), CM_1V8 (out), CM_3V3 (out), ETHERNET (bidir, harness ETHERNET), GND (in), GPIO_REFS (harness GPIO_REFS), MOD_CTL (harness MOD_CTL), RPI_HEADER (harness RPI_HEADER), uSD (harness uSD), VDD_5V (in)

### Harnesses
GPIO_REFS: GPIO0-27_VREF
RPI_HEADER: GPIO2/SDA1, GPIO3/SCL1, GPIO4/GPIO_GCLK/CAM1_IO1, GPIO5/CAM1_IO0, GPIO6, GPIO7/SPI_CE1_N, GPIO8/SPI_CE0_N, GPIO9/SPI_MISO, GPIO10/SPI_MOSI, GPIO12, GPIO13, GPIO14/TXD0, GPIO15/RXD0, GPIO16, GPIO17/GPI0_GEN0, GPIO18/GPI0_GEN1, GPIO19, GPIO20, GPIO21, GPIO22/GPIO_GEN3, GPIO23/GPIO_GEN4, GPIO24/GPIO_GEN5, GPIO25/GPIO_GEN6, GPIO26, GPIO27/GPIO_GEN2, GPIO11/SPI_SCLK
AV: GPIO12/AUD_R, GPIO13/AUD_L, TVDAC
BootSel: EMMC_DISABLE_N
MOD_CTL: GPIO1/MRST
CAM1_GPIO: GPIO4/GPIO_GCLK/CAM1_IO1, GPIO5/CAM1_IO0
ETHERNET: TRD1_P, TRD1_N, TRD2_P, TRD2_N, TRD3_P, TRD3_N, TRD4_P, TRD4_N, ETH_LEDG, ETH_LEDY, ETH_LEDY2
uSD: SDX_D2, SDX_D3, SDX_CMD, SDX_CLK, SDX_D0, SDX_D1, SD_PWR_ON, SD_DETECT
CD1_CAM_DISP: CD1_SCL, CD1_SDA

### Nets
1V8: R63.1 ; port 1V8
3V3: R16.2 R56.2 R57.2 R66.1 R100.2 R101.2 U11.5(VCC) ; port 3V3
CM_1V8: C89.1 CM4.88(CM4_1.8V_(Output)) CM4.90(CM4_1.8V_(Output)) R63.2 ; port CM_1V8
CM_3V3: C91.1 CM4.84(CM4_3.3V_(Output)) CM4.86(CM4_3.3V_(Output)) R66.2 ; port CM_3V3
GND: C89.2 C91.2 C92.2 CM4.1(GND) CM4.2(GND) CM4.7(GND) CM4.8(GND) CM4.13(GND) CM4.14(GND) CM4.22(GND) CM4.23(GND) CM4.32(GND) CM4.33(GND) CM4.42(GND) CM4.43(GND) CM4.52(GND) CM4.53(GND) CM4.59(GND) CM4.60(GND) CM4.65(GND) CM4.66(GND) CM4.71(GND) CM4.74(GND) CM4.98(GND) J16.2 J20.3 J26.2 U11.3(GND) ; port GND
VDD_5V: C92.1 CM4.77(+5V_(Input)) CM4.79(+5V_(Input)) CM4.81(+5V_(Input)) CM4.83(+5V_(Input)) CM4.85(+5V_(Input)) CM4.87(+5V_(Input)) ; port VDD_5V
C_GPIO/MWAKE: CM4.97(Camera_GPIO)
CD1_SCL: CM4.80(I2C_SCL0) R56.1 ; port CD1_CAM_DISP.CD1_SCL
CD1_SDA: CM4.82(I2C_SDA0) R57.1 ; port CD1_CAM_DISP.CD1_SDA
ETH_LEDG: CM4.15(Ethernet_nLED3G) ; port ETHERNET.ETH_LEDG
ETH_LEDY: CM4.17(Ethernet_nLED2Y) ; port ETHERNET.ETH_LEDY
ETH_LEDY2: CM4.19(Ethernet_nLED1Y) ; port ETHERNET.ETH_LEDY2
GLOBAL_EN: CM4.99(GLOBAL_EN) J26.3
GPIO0-27_VREF: CM4.78(GPIO_VREF) R54.2 R55.2 ; port GPIO_REFS.GPIO0-27_VREF
GPIO0/MPGOOD: CM4.36(ID_SD)
GPIO1/MRST: CM4.35(ID_SC) ; port MOD_CTL.GPIO1/MRST
GPIO2/SDA1: CM4.58(GPIO2) R54.1 ; port RPI_HEADER.GPIO2/SDA1
GPIO3/SCL1: CM4.56(GPIO3) R55.1 ; port RPI_HEADER.GPIO3/SCL1
GPIO4/GPIO_GCLK/CAM1_IO1: CM4.54(GPIO4) ; port RPI_HEADER.GPIO4/GPIO_GCLK/CAM1_IO1, port CAM1_GPIO.GPIO4/GPIO_GCLK/CAM1_IO1
GPIO5/CAM1_IO0: CM4.34(GPIO5) ; port RPI_HEADER.GPIO5/CAM1_IO0, port CAM1_GPIO.GPIO5/CAM1_IO0
GPIO6: CM4.30(GPIO6) ; port RPI_HEADER.GPIO6
GPIO7/SPI_CE1_N: CM4.37(GPIO7) ; port RPI_HEADER.GPIO7/SPI_CE1_N
GPIO8/SPI_CE0_N: CM4.39(GPIO8) ; port RPI_HEADER.GPIO8/SPI_CE0_N
GPIO9/SPI_MISO: CM4.40(GPIO9) ; port RPI_HEADER.GPIO9/SPI_MISO
GPIO10/SPI_MOSI: CM4.44(GPIO10) ; port RPI_HEADER.GPIO10/SPI_MOSI
GPIO11/SPI_SCLK: CM4.38(GPIO11) ; port RPI_HEADER.GPIO11/SPI_SCLK
GPIO12/AUD_R: CM4.31(GPIO12) ; port RPI_HEADER.GPIO12, port AV.GPIO12/AUD_R
GPIO13/AUD_L: CM4.28(GPIO13) ; port RPI_HEADER.GPIO13, port AV.GPIO13/AUD_L
GPIO14/TXD0: CM4.55(GPIO14) ; port RPI_HEADER.GPIO14/TXD0
GPIO15/RXD0: CM4.51(GPIO15) ; port RPI_HEADER.GPIO15/RXD0
GPIO16: CM4.29(GPIO16) ; port RPI_HEADER.GPIO16
GPIO17/GPI0_GEN0: CM4.50(GPIO17) ; port RPI_HEADER.GPIO17/GPI0_GEN0
GPIO18/GPI0_GEN1: CM4.49(GPIO18) ; port RPI_HEADER.GPIO18/GPI0_GEN1
GPIO19: CM4.26(GPIO19) ; port RPI_HEADER.GPIO19
GPIO20: CM4.27(GPIO20) ; port RPI_HEADER.GPIO20
GPIO21: CM4.25(GPIO21) ; port RPI_HEADER.GPIO21
GPIO22/GPIO_GEN3: CM4.46(GPIO22) ; port RPI_HEADER.GPIO22/GPIO_GEN3
GPIO23/GPIO_GEN4: CM4.47(GPIO23) ; port RPI_HEADER.GPIO23/GPIO_GEN4
GPIO24/GPIO_GEN5: CM4.45(GPIO24) ; port RPI_HEADER.GPIO24/GPIO_GEN5
GPIO25/GPIO_GEN6: CM4.41(GPIO25) ; port RPI_HEADER.GPIO25/GPIO_GEN6
GPIO26: CM4.24(GPIO26) ; port RPI_HEADER.GPIO26
GPIO27/GPIO_GEN2: CM4.48(GPIO27) ; port RPI_HEADER.GPIO27/GPIO_GEN2
nRPIBOOT: CM4.93(nRPIBOOT) ; port BootSel.EMMC_DISABLE_N
PI_LED_nPWR: CM4.95(PI_LED_nPWR) U11.2(A2)
RUN_PG: CM4.92(RUN_PG) J26.1
SD_DETECT: CM4.76(Reserved) ; port uSD.SD_DETECT
SD_PWR_ON: CM4.75(SD_PWR_ON) ; port uSD.SD_PWR_ON
SDX_CLK: CM4.57(SD_CLK) ; port uSD.SDX_CLK
SDX_CMD: CM4.62(SD_CMD) ; port uSD.SDX_CMD
SDX_D0: CM4.63(SD_DAT0) ; port uSD.SDX_D0
SDX_D1: CM4.67(SD_DAT1) ; port uSD.SDX_D1
SDX_D2: CM4.69(SD_DAT2) ; port uSD.SDX_D2
SDX_D3: CM4.61(SD_DAT3) ; port uSD.SDX_D3
SDX_VDD: CM4.73(SD_VDD_Override) R16.1
TRD1_N: CM4.10(Ethernet_Pair0_N) ; port ETHERNET.TRD1_N
TRD1_P: CM4.12(Ethernet_Pair0_P) ; port ETHERNET.TRD1_P
TRD2_N: CM4.6(Ethernet_Pair1_N) ; port ETHERNET.TRD2_N
TRD2_P: CM4.4(Ethernet_Pair1_P) ; port ETHERNET.TRD2_P
TRD3_N: CM4.9(Ethernet_Pair2_N) ; port ETHERNET.TRD3_N
TRD3_P: CM4.11(Ethernet_Pair2_P) ; port ETHERNET.TRD3_P
TRD4_N: CM4.5(Ethernet_Pair3_N) ; port ETHERNET.TRD4_N
TRD4_P: CM4.3(Ethernet_Pair3_P) ; port ETHERNET.TRD4_P
TVDAC: port AV.TVDAC
NetCM4_16: CM4.16(Ethernet_SYNC_IN) J27.1
NetCM4_18: CM4.18(Ethernet_SYNC_OUT) J27.2
NetCM4_20: CM4.20(EEPROM_nWP) J20.1 J20.2
NetCM4_21: CM4.21(Pi_nLED_Activity) D4.1(C)
NetCM4_89: CM4.89(WL_nDisable) J16.3
NetCM4_91: CM4.91(BT_nDisable) J16.1
NetD4_2: D4.2(A) R100.1
NetD5_1: D5.1(C) U11.4(Y2)
NetD5_2: D5.2(A) R101.1

Not connected (* = marked no-connect by the designer): CM4 64(SD_DAT5)* 68(SD_DAT4)* 70(SD_DAT7)* 72(SD_DAT6)* 94(AnalogIP1)* 96(AnalogIP0)* 100(nEXTRST)*; J27 3

### Layout directives
net class Power_trace: CM_1V8, CM_3V3, VDD_5V
differential pair; net class ETH; differential pair class 100ohm: TRD1_N, TRD1_P, TRD2_N, TRD2_P, TRD3_N, TRD3_P, TRD4_N, TRD4_P

### Notes on the sheet
- (near J20) Dis
- En
- (near R16) Force SDCARD/eMMC interface to 1.8V signalling if set to 3.3V, otherwise leave unconnected. Typically only used if external eMMC is connected.
- (near J16) Label header pins on layout.
- Dis WF
- Dis BT
- Header allows for user reset of CM3 by pulling "RUN" net to GND.
- (near J26) Dis
- Header allows for power down CM4 by pulling "nPWR_DOWN" net to GND. Needs to be pulled low to restart power.
- Title
- Size:
- Date:
- Tabloid
- Number:
- Time:
- Revision:
- Sheet
- of
- Drawn by:
- (in symbol CM4, part B) Low; PWM0_1; High; PWM0_0; GPIO0 (SDA1); GPIO1 (SCL1); SPI0_CE1; SPI0_CLK; SPI0_CE0; SPI0_MISO; SPI0_MOSI; RXD0; GPCLK0; TXD0; SCL1; SDA1; GPIO45 (SCL0); GPIO44 (SDA0)

### Library data of the parts
C89 C91 C92 = GRM188R61A226ME15D: CAP CER 22UF 10V X5R 0603 20%; Manufacturer 1: Murata; Material: Ceramic; Manufacturer Part Number 1: GRM188R61A226ME15D; ComponentLink1URL: https://datasheet.ciiva.com/46444/1769893-46444975.pdf?src-supplier=Element14; ComponentLink1Description: https://datasheet.ciiva.com/46444/1769893-46444975.pdf?src-supplier=Element14; Supplier 1: Digi-Key; Stock 1: 984716; Pricing 1: 1=0.31000, 10=0.21500, 100=0.12160, 500=0.08584, 1000=0.07512 (USD); RoHS: Yes; Mount: Surface Mount; Case/Package: 0603; Weight: 0.000222oz; Case Code (Metric): 1608; Case Code (Imperial): 0603; Min Operating Temperature: -55°C; Max Operating Temperature: 85°C; Capacitance: 22uF; Tolerance: 20%; Packaging: Tape and Reel; Dielectric: X5R; Voltage Rating (DC): 10V; Termination: SMD/SMT; Package Quantity: 4000; Length: 1.6mm; Height: 0.8mm; Width: 0.8mm; Thickness: 0.039inch; Depth: 0.8mm; REACH SVHC: No SVHC; Lead Free: Lead Free; Supplier Part Number 1: 490-10476-1-ND
CM4 = CM4: Raspberry Pi Compute Module 4 / Two receptacle 100-pin connectors; Manufacturer 1: Hirose; Manufacturer Part Number 1: DF40HC(3.0)-100DS-0.4V(51; ComponentLink1Description: https://datasheet.ciiva.com/46636/ed-df40-20140305-46636517.pdf?src-supplier=Digi-Key; ComponentLink1URL: https://datasheet.ciiva.com/46636/ed-df40-20140305-46636517.pdf?src-supplier=Digi-Key; ComponentLink2Description: https://datasheet.ciiva.com/18562/ed-df40-20140305-18562189.pdf?src-supplier=Digi-Key; ComponentLink2URL: https://datasheet.ciiva.com/18562/ed-df40-20140305-18562189.pdf?src-supplier=Digi-Key; ComponentLink3Description: https://datasheet.ciiva.com/13559/ed-df40-20140305-13559540.pdf?src-supplier=Mouser; ComponentLink3URL: https://datasheet.ciiva.com/13559/ed-df40-20140305-13559540.pdf?src-supplier=Mouser; ComponentLink4Description: https://datasheet.ciiva.com/18562/ed-df40-20140305-18562462.pdf?src-supplier=Digi-Key; ComponentLink4URL: https://datasheet.ciiva.com/18562/ed-df40-20140305-18562462.pdf?src-supplier=Digi-Key
D4 = SML-D12M8WT86: LED GREEN DIFFUSED 0603 SMD Green 572nm LED Indication - Discrete 2.2V 0603 (1608 Metric); Manufacturer: Rohm; Colour: Green,Yellow; Lens Colour: White,Clear,Diffused; Lens Style: Diffused,Colorless,Rectangular; Forward Current: 20mA; Luminous Intensity: 25mcd; Number of LEDs: 1; Viewing Angle: 160°; Lens Color: White,Diffused; Supplier 1: Digi-Key; Stock 1: 112971; Pricing 1: 1=0.33000, 10=0.23900, 100=0.11340, 500=0.07560, 1000=0.05922 (USD); Mount: Surface Mount; Case/Package: 0603; Number of Pins: 2; Case Code (Metric): 1608; Case Code (Imperial): 0603; Min Operating Temperature: -40°C; Max Operating Temperature: 85°C; Forward Voltage: 2.2V; Packaging: Tape and Reel; Dominant Wavelength: 572nm; Wavelength: 572nm; Illumination Colour: Green; Package Quantity: 1; Test Current: 20mA; Lens Transparency: Diffused; Length: 1.6mm; Height: 0.65mm; Width: 0.8mm; Radiation Hardening: No; REACH SVHC: Unknown; Lead Free: Lead Free; ComponentLink1URL: https://datasheet.ciiva.com/11774/0900766b80df3ada-11774260.pdf; ComponentLink1Description: https://datasheet.ciiva.com/11774/0900766b80df3ada-11774260.pdf; ComponentLink2URL: https://datasheet.ciiva.com/3161/sml-d1-3161419.pdf; ComponentLink2Description: https://datasheet.ciiva.com/3161/sml-d1-3161419.pdf; ComponentLink3URL: https://datasheet.ciiva.com/2110/sml-d1-2110396.pdf; ComponentLink3Description: https://datasheet.ciiva.com/2110/sml-d1-2110396.pdf; ComponentLink4URL: https://datasheet.ciiva.com/2110/sml-d1-2110397.pdf; ComponentLink4Description: https://datasheet.ciiva.com/2110/sml-d1-2110397.pdf; ComponentLink5URL: https://datasheet.ciiva.com/2110/sml-d1-2110398.pdf; ComponentLink5Description: https://datasheet.ciiva.com/2110/sml-d1-2110398.pdf; Manufacturer Part Number: SML-D12M8WT86; Manufacturer 1: Rohm; Manufacturer Part Number 1: SML-D12M8WT86; RoHS: Yes; Color: Green,Yellow; Illumination Color: Green; ComponentLink6URL: https://datasheet.ciiva.com/11774/0900766b80df3ada-11774260.pdf?src-supplier=RSComponents; ComponentLink6Description: https://datasheet.ciiva.com/11774/0900766b80df3ada-11774260.pdf?src-supplier=RSComponents; ComponentLink7URL: https://datasheet.ciiva.com/3161/sml-d1-3161419.pdf?src-supplier=Avnet; ComponentLink7Description: https://datasheet.ciiva.com/3161/sml-d1-3161419.pdf?src-supplier=Avnet; ComponentLink8URL: https://datasheet.ciiva.com/2110/sml-d1-2110396.pdf?src-supplier=Digi-Key; ComponentLink8Description: https://datasheet.ciiva.com/2110/sml-d1-2110396.pdf?src-supplier=Digi-Key; ComponentLink9URL: https://datasheet.ciiva.com/2110/sml-d1-2110397.pdf?src-supplier=Digi-Key; ComponentLink9Description: https://datasheet.ciiva.com/2110/sml-d1-2110397.pdf?src-supplier=Digi-Key; ComponentLink10URL: https://datasheet.ciiva.com/2110/sml-d1-2110398.pdf?src-supplier=Digi-Key; ComponentLink10Description: https://datasheet.ciiva.com/2110/sml-d1-2110398.pdf?src-supplier=Digi-Key; Supplier Part Number 1: 511-1578-1-ND
D5 = SML-D12U8WT86: LED RED DIFFUSED 0603 SMD Red 620nm LED Indication - Discrete 2.2V 0603 (1608 Metric); Manufacturer 1: Rohm; Lens Style: Rectangular,Diffused,Colorless; Forward Current: 20mA; Luminous Intensity: 63mcd; Number of LEDs: 1; Viewing Angle: 160°; Lens Color: White,Clear,Diffused; Supplier 1: Digi-Key; Stock 1: 63748; Pricing 1: 1=0.33000, 10=0.23900, 100=0.11340, 500=0.07560, 1000=0.05922 (USD); Mount: Surface Mount; Case/Package: 0603; Number of Pins: 2; Case Code (Metric): 1608; Case Code (Imperial): 0603; Min Operating Temperature: -40°C; Max Operating Temperature: 85°C; Forward Voltage: 2.2V; Packaging: Tape and Reel; Dominant Wavelength: 620nm; Wavelength: 620nm; Package Quantity: 1; Test Current: 20mA; Lens Transparency: Diffused; Length: 1.6mm; Height: 0.65mm; Width: 0.8mm; Radiation Hardening: No; REACH SVHC: No SVHC; Lead Free: Lead Free; ComponentLink1URL: https://datasheet.ciiva.com/11774/0900766b80df3ada-11774020.pdf?src-supplier=RSComponents; ComponentLink1Description: https://datasheet.ciiva.com/11774/0900766b80df3ada-11774020.pdf?src-supplier=RSComponents; ComponentLink2URL: https://datasheet.ciiva.com/2110/sml-d1-2110375.pdf?src-supplier=Digi-Key; ComponentLink2Description: https://datasheet.ciiva.com/2110/sml-d1-2110375.pdf?src-supplier=Digi-Key; ComponentLink3URL: https://datasheet.ciiva.com/2110/sml-d1-2110376.pdf?src-supplier=Digi-Key; ComponentLink3Description: https://datasheet.ciiva.com/2110/sml-d1-2110376.pdf?src-supplier=Digi-Key; ComponentLink4URL: https://datasheet.ciiva.com/2110/sml-d1-2110377.pdf?src-supplier=Digi-Key; ComponentLink4Description: https://datasheet.ciiva.com/2110/sml-d1-2110377.pdf?src-supplier=Digi-Key; ComponentLink5URL: https://datasheet.ciiva.com/9324/sml-d1-9324826.pdf?src-supplier=Avnet; ComponentLink5Description: https://datasheet.ciiva.com/9324/sml-d1-9324826.pdf?src-supplier=Avnet; RoHS: Yes; Color: Red; Illumination Color: Red; ComponentLink6URL: https://datasheet.ciiva.com/17420/sml-d1-17420939.pdf?src-supplier=Avnet+Europe; ComponentLink6Description: https://datasheet.ciiva.com/17420/sml-d1-17420939.pdf?src-supplier=Avnet+Europe; Supplier Part Number 1: 511-1580-1-ND; Manufacturer Part Number 1: SML-D12U8WT86
J16 J20 J26 J27 = GRPB031VWVN-RC: CONN HEADER VERT 3POS 1.27MM; Manufacturer 1: Sullins; Number of Positions: 3; Connector Type: Male Pin; Pitch: 0.05inch; Manufacturer Part Number 1: GRPB031VWVN-RC; Supplier 1: Digi-Key; Stock 1: 114623; Pricing 1: 1=0.28000, 10=0.26100, 100=0.18300, 500=0.15688, 1000=0.13073, 5000=0.11205, 10000=0.10790 (USD); RoHS: Yes; Mount: Through Hole; Contact Plating: Gold; Package Quantity: 1; Number of Rows: 1; Packaging: Bulk; Termination: Solder; Contact Mating Length: 0.118inch; Lead Free: Lead Free; ComponentLink1URL: https://datasheet.ciiva.com/726/71-grpb-1vwvn-rc-10957-c-726649.pdf?src-supplier=Digi-Key; ComponentLink1Description: https://datasheet.ciiva.com/726/71-grpb-1vwvn-rc-10957-c-726649.pdf?src-supplier=Digi-Key; Supplier 2: Future Electronics; Supplier Part Number 1: S9014E-03-ND; Supplier Part Number 2: GRPB031VWVN-RC-BAG
J17 J24 J29 = M50-1900005: CONN SHUNT 1.27MM BLACK; Manufacturer 1: Harwin; Number of Positions: 2; Number of Contacts: 3; Max Current Rating: 1A; Contact Resistance: 20mR; Insulation Resistance: 1R; Voltage Rating: 500V; Manufacturer Part Number 1: M50-1900005; RoHS: Yes; Contact Plating: Gold; Contact Material: Copper Alloy; Color: Black; Housing Material: Nylon; Housing Color: Black; Min Operating Temperature: -40°C; Max Operating Temperature: 105°C; Package Quantity: 1000; Packaging: Bulk; Number of Rows: 1; Orientation: Straight; Length: 2.5mm; Height: 0.118inch; Radiation Hardening: No; REACH SVHC: No SVHC; Flammability Rating: UL94 V-0; ComponentLink1URL: https://datasheet.ciiva.com/767/m50-19x-767925.pdf?src-supplier=Digi-Key; ComponentLink1Description: https://datasheet.ciiva.com/767/m50-19x-767925.pdf?src-supplier=Digi-Key; ComponentLink2URL: https://datasheet.ciiva.com/1412/1836978-1412124.pdf?src-supplier=Element14; ComponentLink2Description: https://datasheet.ciiva.com/1412/1836978-1412124.pdf?src-supplier=Element14; Supplier 1: Digi-Key; Stock 1: 19754; Pricing 1: 1=0.33000, 10=0.30800, 25=0.26400, 50=0.22440, 100=0.21560, 250=0.19360, 500=0.18480, 1000=0.15400, 2500=0.14080 (USD); Current Rating: 1A; Pitch: 1.27mm; Depth: 3mm; Supplier Part Number 1: 952-1730-ND
R16 R54-R57 = RC0402FR-071K8L: RES SMD 1.8K OHM 1% 1/16W 0402; Manufacturer 1: Yageo; Resistance: 1.8kR; Temperature Coefficient: 100ppm/°C; Power Rating: 63mW; Voltage Rating: 50V; Manufacturer Part Number 1: RC0402FR-071K8L; Supplier 1: Digi-Key; Stock 1: 1041820; Pricing 1: 1=0.10000, 10=0.01600, 100=0.00640, 1000=0.00289, 2500=0.00251, 5000=0.00207 (USD); RoHS: Yes; Case/Package: 0402; Case Code (Imperial): 0402; Case Code (Metric): 1005; Min Operating Temperature: -55°C; Max Operating Temperature: 155°C; Tolerance: 1%; Packaging: Tape and Reel; Composition: Thick Film; Package Quantity: 1; Termination: SMD/SMT; Number of Terminations: 2; Max Power Dissipation: 63mW; Military Standard: Not; Features: Moisture Resistant; Working Voltage: 50V; Length: 1mm; Height: 0.016inch; Width: 0.02inch; Depth: 0.5mm; Lead Free: Lead Free; REACH SVHC: Unknown; ComponentLink1URL: https://datasheet.ciiva.com/11819/0900766b80c66297-11819472.pdf?src-supplier=RSComponents; ComponentLink1Description: https://datasheet.ciiva.com/11819/0900766b80c66297-11819472.pdf?src-supplier=RSComponents; ComponentLink2URL: https://datasheet.ciiva.com/2453/pyu-r-int-thick-7-2453530.pdf?src-supplier=Digi-Key; ComponentLink2Description: https://datasheet.ciiva.com/2453/pyu-r-int-thick-7-2453530.pdf?src-supplier=Digi-Key; ComponentLink3URL: https://datasheet.ciiva.com/7849/1018594-7849868.pdf?src-supplier=Element14; ComponentLink3Description: https://datasheet.ciiva.com/7849/1018594-7849868.pdf?src-supplier=Element14; ComponentLink4URL: https://datasheet.ciiva.com/16744/pyu-rc0402-51-rohs-l-6-r-16744223.pdf?src-supplier=Future+Electronics; ComponentLink4Description: https://datasheet.ciiva.com/16744/pyu-rc0402-51-rohs-l-6-r-16744223.pdf?src-supplier=Future+Electronics; ComponentLink5URL: https://datasheet.ciiva.com/7849/1018594-7849867.pdf?src-supplier=Element14; ComponentLink5Description: https://datasheet.ciiva.com/7849/1018594-7849867.pdf?src-supplier=Element14; ComponentLink6URL: https://datasheet.ciiva.com/12667/pyu-rc0402-51-rohs-l-6-r-12667431.pdf?src-supplier=Mouser; ComponentLink6Description: https://datasheet.ciiva.com/12667/pyu-rc0402-51-rohs-l-6-r-12667431.pdf?src-supplier=Mouser; ComponentLink7URL: https://datasheet.ciiva.com/2453/pyu-r-int-thick-7-2453529.pdf?src-supplier=Digi-Key; ComponentLink7Description: https://datasheet.ciiva.com/2453/pyu-r-int-thick-7-2453529.pdf?src-supplier=Digi-Key; ComponentLink8URL: https://datasheet.ciiva.com/2453/pyu-r-int-thick-7-2453531.pdf?src-supplier=Digi-Key; ComponentLink8Description: https://datasheet.ciiva.com/2453/pyu-r-int-thick-7-2453531.pdf?src-supplier=Digi-Key; Supplier 2: Mouser; Supplier Part Number 2: 603-RC0402FR-071K8L; Supplier Part Number 1: 311-1.80KLRCT-ND
R63 R66 = CRCW04020000Z0ED: RES SMD 0 OHM JUMPER 1/16W 0402; Manufacturer 1: Vishay; Resistance: 0mR; Power Rating: 63mW; Voltage Rating: 50V; Temperature Coefficient: 100ppm/°C; Tolerance: 5%; Manufacturer Part Number 1: CRCW04020000Z0ED; Supplier 1: Digi-Key; Stock 1: 855968; Pricing 1: 1=0.10000, 10=0.03400, 25=0.02440, 50=0.01860, 100=0.01380, 250=0.01048, 500=0.00840, 1000=0.00618, 5000=0.00443 (USD); RoHS: Yes; Mount: Surface Mount; Case/Package: 0402; Weight: 2.3E-05oz; Case Code (Imperial): 0402; Case Code (Metric): 1005; Contact Plating: Tin; Min Operating Temperature: -55°C; Max Operating Temperature: 155°C; Packaging: Tape and Reel; Composition: Thick Film; Voltage Rating (DC): 50V; Package Quantity: 1; Termination: SMD/SMT; Number of Terminations: 2; Military Standard: Not; Max Power Dissipation: 63mW; Features: Automotive AEC-Q200; Length: 1mm; Height: 0.35mm; Width: 0.5mm; Depth: 0.5mm; Radiation Hardening: No; REACH SVHC: Unknown; Lead Free: Lead Free; ComponentLink1URL: https://datasheet.ciiva.com/3255/dcrcwe3-3255944.pdf?src-supplier=Avnet; ComponentLink1Description: https://datasheet.ciiva.com/3255/dcrcwe3-3255944.pdf?src-supplier=Avnet; ComponentLink2URL: https://datasheet.ciiva.com/3255/dcrcwe3-3255945.pdf?src-supplier=Avnet; ComponentLink2Description: https://datasheet.ciiva.com/3255/dcrcwe3-3255945.pdf?src-supplier=Avnet; ComponentLink3URL: https://datasheet.ciiva.com/16881/dcrcwe3-16881413.pdf?src-supplier=Avnet+Europe; ComponentLink3Description: https://datasheet.ciiva.com/16881/dcrcwe3-16881413.pdf?src-supplier=Avnet+Europe; ComponentLink4URL: https://datasheet.ciiva.com/2461/dcrcwe3-2461962.pdf?src-supplier=Digi-Key; ComponentLink4Description: https://datasheet.ciiva.com/2461/dcrcwe3-2461962.pdf?src-supplier=Digi-Key; ComponentLink5URL: https://datasheet.ciiva.com/7841/1720486-7841802.pdf?src-supplier=Element14; ComponentLink5Description: https://datasheet.ciiva.com/7841/1720486-7841802.pdf?src-supplier=Element14; ComponentLink6URL: https://datasheet.ciiva.com/2461/dcrcwe3-2461963.pdf?src-supplier=Digi-Key; ComponentLink6Description: https://datasheet.ciiva.com/2461/dcrcwe3-2461963.pdf?src-supplier=Digi-Key; ComponentLink7URL: https://datasheet.ciiva.com/2461/dcrcwe3-2461964.pdf?src-supplier=Digi-Key; ComponentLink7Description: https://datasheet.ciiva.com/2461/dcrcwe3-2461964.pdf?src-supplier=Digi-Key; ComponentLink8URL: https://datasheet.ciiva.com/7841/1697337-7841468.pdf?src-supplier=Element14; ComponentLink8Description: https://datasheet.ciiva.com/7841/1697337-7841468.pdf?src-supplier=Element14; ComponentLink9URL: https://datasheet.ciiva.com/16761/70200976-16761309.pdf?src-supplier=Allied+Electronics; ComponentLink9Description: https://datasheet.ciiva.com/16761/70200976-16761309.pdf?src-supplier=Allied+Electronics; ComponentLink10URL: https://datasheet.ciiva.com/26311/fld-crcw-e3-data-en-26311550.pdf?src-supplier=Distrelec; ComponentLink10Description: https://datasheet.ciiva.com/26311/fld-crcw-e3-data-en-26311550.pdf?src-supplier=Distrelec; Supplier Part Number 1: 541-0.0JCT-ND
R100 R101 = RC0402FR-071KL: RES SMD 1K OHM 1% 1/16W 0402 1 kOhms ±1% 0.063W, 1/16W Chip Resistor 0402 (1005 Metric) Moisture Resistant Thick Film; Manufacturer 1: Yageo; Temperature Coefficient: 100ppm/°C; Power Rating: 62.5mW; Voltage Rating (DC): 50V; Resistance: 1kR; Manufacturer Part Number 1: RC0402FR-071KL; RoHS: Yes; Number of Pins: 2; Case Code (Imperial): 0402; Case Code (Metric): 1005; Min Operating Temperature: -55°C; Max Operating Temperature: 155°C; Packaging: Tape and Reel; Composition: Thick Film; Voltage Rating: 50V; Military Standard: Not; Termination: SMD/SMT; Length: 1mm; Height: 0.32mm; Width: 0.5mm; Depth: 0.5mm; Lead Free: Lead Free; REACH SVHC: Unknown; ComponentLink1URL: https://datasheet.ciiva.com/11819/0900766b80c66297-11819477.pdf?src-supplier=RSComponents; ComponentLink1Description: https://datasheet.ciiva.com/11819/0900766b80c66297-11819477.pdf?src-supplier=RSComponents; ComponentLink2URL: https://datasheet.ciiva.com/12666/pyu-rc0402-51-rohs-l-6-r-12666741.pdf?src-supplier=Mouser; ComponentLink2Description: https://datasheet.ciiva.com/12666/pyu-rc0402-51-rohs-l-6-r-12666741.pdf?src-supplier=Mouser; ComponentLink3URL: https://datasheet.ciiva.com/17063/pyu-rc0402-51-rohs-l-6-r-17063193.pdf?src-supplier=Future+Electronics; ComponentLink3Description: https://datasheet.ciiva.com/17063/pyu-rc0402-51-rohs-l-6-r-17063193.pdf?src-supplier=Future+Electronics; ComponentLink4URL: https://datasheet.ciiva.com/22747/1018594-22747513.pdf?src-supplier=Element14; ComponentLink4Description: https://datasheet.ciiva.com/22747/1018594-22747513.pdf?src-supplier=Element14; ComponentLink5URL: https://datasheet.ciiva.com/7849/1018594-7849869.pdf?src-supplier=Element14; ComponentLink5Description: https://datasheet.ciiva.com/7849/1018594-7849869.pdf?src-supplier=Element14; ComponentLink6URL: https://datasheet.ciiva.com/7983/1018594-7983502.pdf?src-supplier=Element14; ComponentLink6Description: https://datasheet.ciiva.com/7983/1018594-7983502.pdf?src-supplier=Element14; ComponentLink7URL: https://datasheet.ciiva.com/7849/1018594-7849871.pdf?src-supplier=Element14; ComponentLink7Description: https://datasheet.ciiva.com/7849/1018594-7849871.pdf?src-supplier=Element14; Supplier 1: Digi-Key; Stock 1: 60695854; Pricing 1: 1=0.10000, 10=0.01600, 100=0.00670, 1000=0.00301, 2500=0.00261, 5000=0.00215 (USD); Case/Package: 0402; Tolerance: 1%; Supplier Part Number 1: 311-1.00KLRCT-ND
U11 = 74LVC1G07SE-7: SINGLE BUFFER/DRIVER WITH OPEN DRAIN OUTPUT; Manufacturer 1: Diodes Incorporated; Supplier 1: Digi-Key; Manufacturer Part Number 1: 74LVC1G07SE-7; ComponentLink1URL: https://datasheet.ciiva.com/5701/1725615-5701889.pdf?src-supplier=Farnell; ComponentLink1Description: https://datasheet.ciiva.com/5701/1725615-5701889.pdf?src-supplier=Farnell; ComponentLink2URL: https://datasheet.ciiva.com/15094/getdatasheetpartid-92041-15094657.pdf?src-supplier=Verical; ComponentLink2Description: https://datasheet.ciiva.com/15094/getdatasheetpartid-92041-15094657.pdf?src-supplier=Verical; ComponentLink3URL: https://datasheet.ciiva.com/27051/1028128-27051265.pdf?src-supplier=Jameco; ComponentLink3Description: https://datasheet.ciiva.com/27051/1028128-27051265.pdf?src-supplier=Jameco; ComponentLink4URL: https://datasheet.ciiva.com/8260/nc7wz16-8260101.pdf?src-supplier=Avnet; ComponentLink4Description: https://datasheet.ciiva.com/8260/nc7wz16-8260101.pdf?src-supplier=Avnet; ComponentLink5URL: https://datasheet.ciiva.com/17332/nc7wz16-17332853.pdf?src-supplier=Future+Electronics; ComponentLink5Description: https://datasheet.ciiva.com/17332/nc7wz16-17332853.pdf?src-supplier=Future+Electronics; ComponentLink6URL: https://datasheet.ciiva.com/8260/nc7wz16-8260105.pdf?src-supplier=Avnet; ComponentLink6Description: https://datasheet.ciiva.com/8260/nc7wz16-8260105.pdf?src-supplier=Avnet; ComponentLink7URL: https://datasheet.ciiva.com/26096/nc7wz16-26096508.pdf?src-supplier=Avnet+Europe; ComponentLink7Description: https://datasheet.ciiva.com/26096/nc7wz16-26096508.pdf?src-supplier=Avnet+Europe